# EAGLE design NB-IoT-ideaboard-v2.0 (EAGLE 8.7.1)

## Sheet 1 of 4
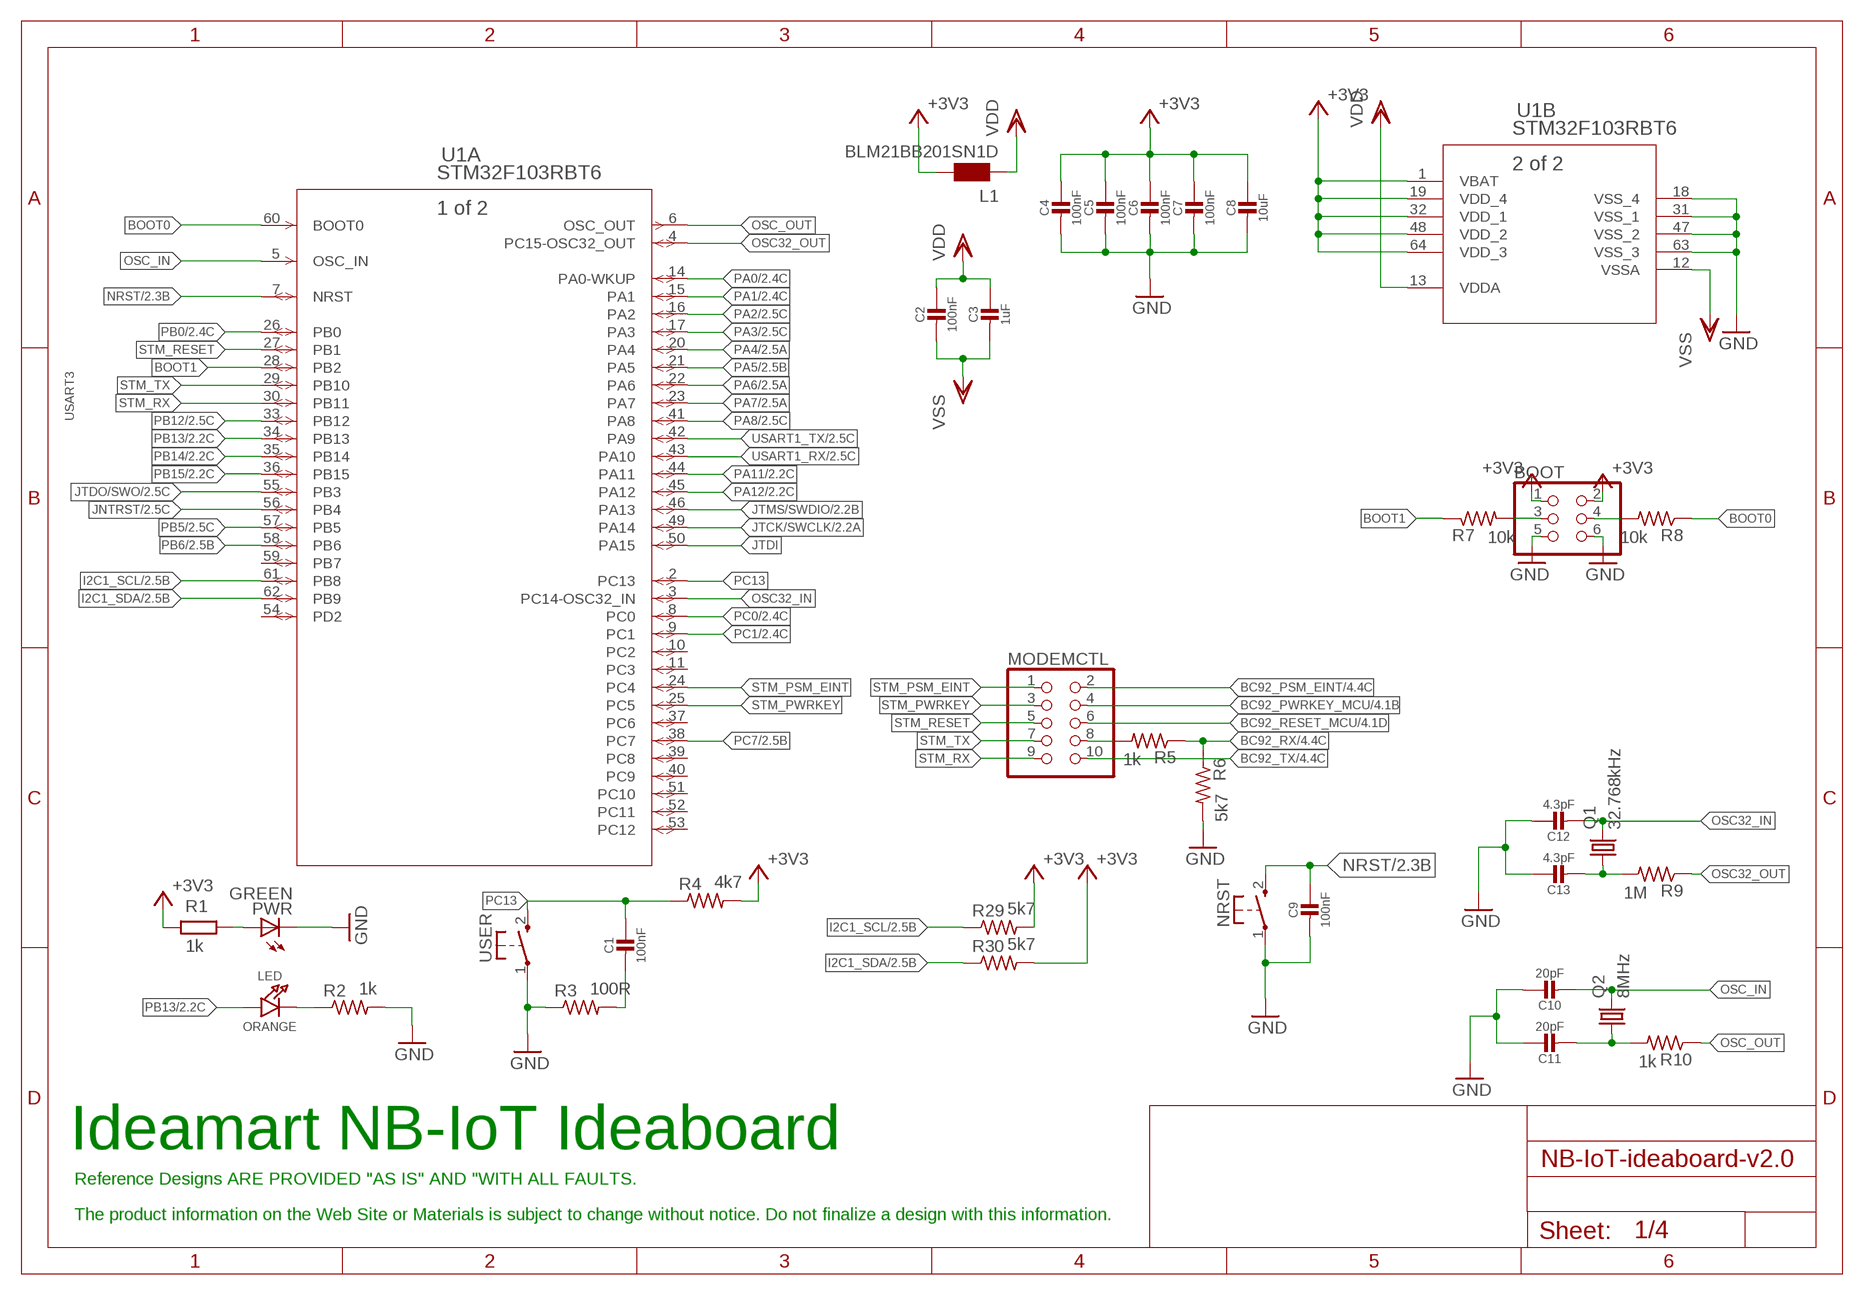
[diagram p0: schematic, sheet 1]

### Parts
BOOT  PINHD-2X03_2.54-SMD  [2X03SMD]
C1  100nF  CAP_CERAMIC_0805MP  [_0805MP]
C2  100nF  CAP_CERAMIC_0805MP  [_0805MP]
C3  1uF  CAP_CERAMIC_0805MP  [_0805MP]
C4  100nF  CAP_CERAMIC_0805MP  [_0805MP]
C5  100nF  CAP_CERAMIC_0805MP  [_0805MP]
C6  100nF  CAP_CERAMIC_0805MP  [_0805MP]
C7  100nF  CAP_CERAMIC_0805MP  [_0805MP]
C8  10uF  CAP_CERAMIC_0805MP  [_0805MP]
C9  100nF  CAP_CERAMIC_0805MP  [_0805MP]
C10  20pF  CAP_CERAMIC_0805MP  [_0805MP]
C11  20pF  CAP_CERAMIC_0805MP  [_0805MP]
C12  4.3pF  CAP_CERAMIC_0805MP  [_0805MP]
C13  4.3pF  CAP_CERAMIC_0805MP  [_0805MP]
L1  BLM21BB201SN1D  WE-CBF_0805  [0805]
LED  ORANGE  LED0805  [CHIPLED_0805]
MODEMCTL  PINHD-2X05_2.54-SMD  [2X05SMD]
NRST  KSS-2EG4430  [KSS-2EG4430]
PWR  GREEN  LEDCHIP-LED0805  [CHIP-LED0805]
Q1  32.768kHz  CRYSTALTC26H-SMD  [TC26H-SMD]
Q2  8MHz  CRYSTALSM49  [SM49]
R1  1k  R-EU_R0805  [R0805]
R2  1k  R-US_M0805  [M0805]
R3  100R  R-US_M0805  [M0805]
R4  4k7  R-US_M0805  [M0805]
R5  1k  R-US_M0805  [M0805]
R6  5k7  R-US_M0805  [M0805]
R7  10k  R-US_M0805  [M0805]
R8  10k  R-US_M0805  [M0805]
R9  1M  R-US_M0805  [M0805]
R10  1k  R-US_M0805  [M0805]
R29  5k7  R-US_M0805  [M0805]
R30  5k7  R-US_M0805  [M0805]
U1  STM32F103RBT6  [LQFP64-10X10MM]
USER  KSS-2EG4430  [KSS-2EG4430]

### Nets
+3V3: BOOT.1 BOOT.2 C4.1 C5.1 C6.1 C7.1 C8.1 L1.2 R1.2 R4.2 R29.2 R30.2 U1.1(B:VBAT) U1.19(B:VDD_4) U1.32(B:VDD_1) U1.48(B:VDD_2) U1.64(B:VDD_3) ; also sheet 2,3
BC92_PSM_EINT: MODEMCTL.2 ; also sheet 4
BC92_PWRKEY_MCU: MODEMCTL.4 ; also sheet 4
BC92_RESET_MCU: MODEMCTL.6 ; also sheet 4
BC92_RX: R5.1 R6.1 ; also sheet 4
BC92_TX: MODEMCTL.10 ; also sheet 4
BOOT0: R8.1 U1.60(A:BOOT0)
BOOT1: R7.1 U1.28(A:PB2)
GND [gnd]: BOOT.5 BOOT.6 C4.2 C5.2 C6.2 C7.2 C8.2 C9.2 C10.1 C11.1 C12.1 C13.1 NRST.1(P) PWR.C R2.2 R3.1 R6.2 U1.18(B:VSS_4) U1.31(B:VSS_1) U1.47(B:VSS_2) U1.63(B:VSS_3) USER.1(P) ; also sheet 2,3,4
I2C1_SCL: R29.1 U1.61(A:PB8) ; also sheet 2
I2C1_SDA: R30.1 U1.62(A:PB9) ; also sheet 2
JNTRST: U1.56(A:PB4) ; also sheet 2
JTCK/SWCLK: U1.49(A:PA14) ; also sheet 2
JTDI: U1.50(A:PA15)
JTDO/SWO: U1.55(A:PB3) ; also sheet 2
JTMS/SWDIO: U1.46(A:PA13) ; also sheet 2
N$1: BOOT.3 R7.2
N$3: PWR.A R1.1
N$7: C11.2 Q2.1 R10.2
N$8: C13.2 Q1.P$1 R9.2
N$19: C1.2 R3.2
N$25: BOOT.4 R8.2
N$26: LED.C R2.1
N$29: MODEMCTL.8 R5.2
NRST: C9.1 NRST.2(S) U1.7(A:NRST) ; also sheet 2
OSC32_IN: C12.2 Q1.P$2 U1.3(A:PC14-OSC32_IN)
OSC32_OUT: R9.1 U1.4(A:PC15-OSC32_OUT)
OSC_IN: C10.2 Q2.2 U1.5(A:OSC_IN)
OSC_OUT: R10.1 U1.6(A:OSC_OUT)
PA0: U1.14(A:PA0-WKUP) ; also sheet 2
PA1: U1.15(A:PA1) ; also sheet 2
PA2: U1.16(A:PA2) ; also sheet 2
PA3: U1.17(A:PA3) ; also sheet 2
PA4: U1.20(A:PA4) ; also sheet 2
PA5: U1.21(A:PA5) ; also sheet 2
PA6: U1.22(A:PA6) ; also sheet 2
PA7: U1.23(A:PA7) ; also sheet 2
PA8: U1.41(A:PA8) ; also sheet 2
PA11: U1.44(A:PA11) ; also sheet 2
PA12: U1.45(A:PA12) ; also sheet 2
PB0: U1.26(A:PB0) ; also sheet 2
PB5: U1.57(A:PB5) ; also sheet 2
PB6: U1.58(A:PB6) ; also sheet 2
PB12: U1.33(A:PB12) ; also sheet 2
PB13: LED.A U1.34(A:PB13) ; also sheet 2
PB14: U1.35(A:PB14) ; also sheet 2
PB15: U1.36(A:PB15) ; also sheet 2
PC0: U1.8(A:PC0) ; also sheet 2
PC1: U1.9(A:PC1) ; also sheet 2
PC7: U1.38(A:PC7) ; also sheet 2
PC13: C1.1 R4.1 U1.2(A:PC13) USER.2(S)
STM_PSM_EINT: MODEMCTL.1 U1.24(A:PC4)
STM_PWRKEY: MODEMCTL.3 U1.25(A:PC5)
STM_RESET: MODEMCTL.5 U1.27(A:PB1)
STM_RX: MODEMCTL.9 U1.30(A:PB11)
STM_TX: MODEMCTL.7 U1.29(A:PB10)
USART1_RX: U1.43(A:PA10) ; also sheet 2
USART1_TX: U1.42(A:PA9) ; also sheet 2
VDD: C2.1 C3.1 L1.1 U1.13(B:VDDA) ; also sheet 2
VSS: C2.2 C3.2 U1.12(B:VSSA)
Unconnected: U1.10(A:PC2) U1.11(A:PC3) U1.37(A:PC6) U1.39(A:PC8) U1.40(A:PC9) U1.51(A:PC10) U1.52(A:PC11) U1.53(A:PC12) U1.54(A:PD2) U1.59(A:PB7)

### Notes on the sheet
- USART3
- Ideamart NB-IoT Ideaboard
- Reference Designs ARE PROVIDED "AS IS" AND "WITH ALL FAULTS.
- The product information on the Web Site or Materials is subject to change without notice. Do not finalize a design with this information.

## Sheet 2 of 4
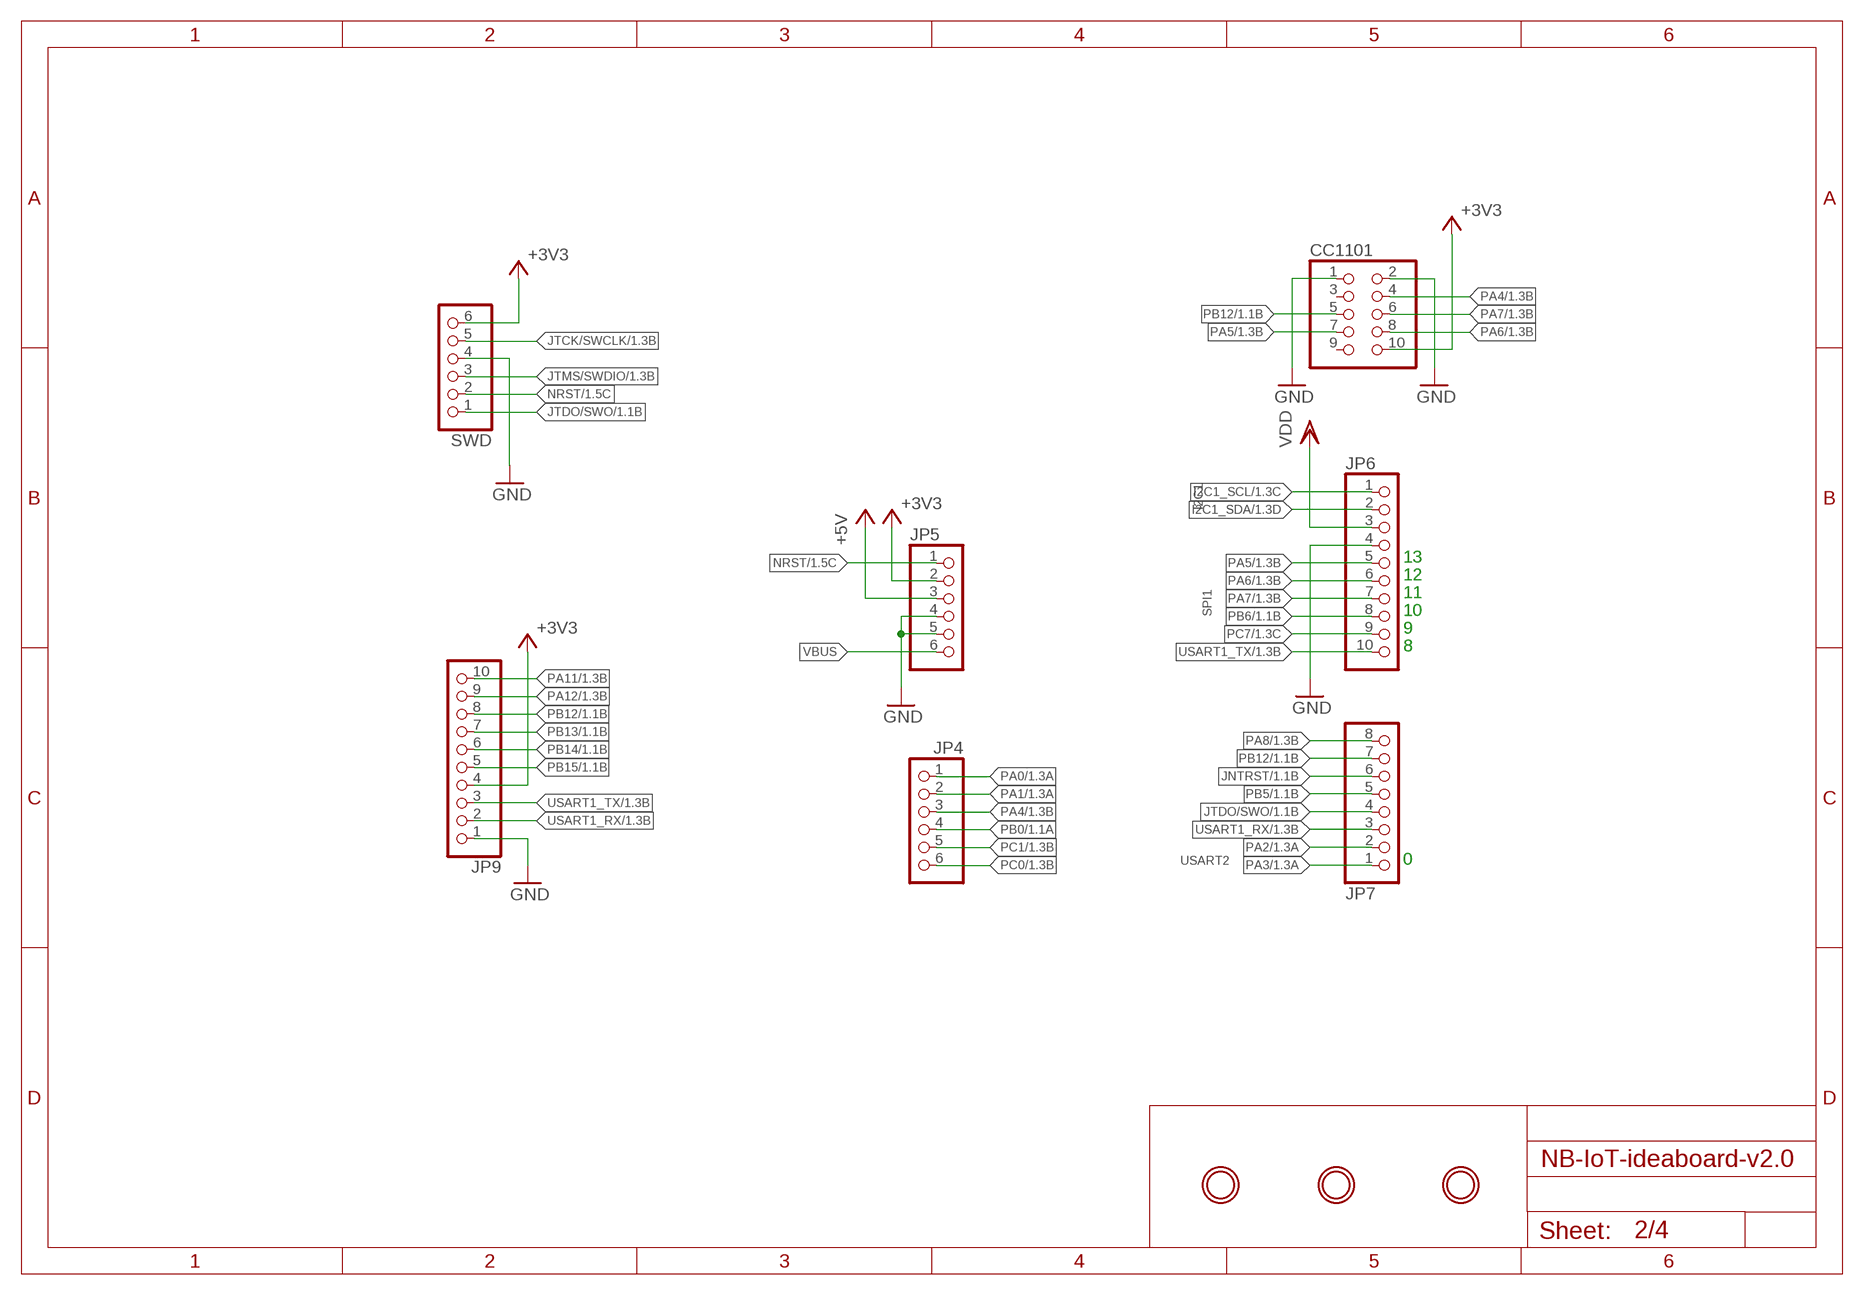
[diagram p1: schematic, sheet 2]

### Parts
$H1  MOUNTINGHOLE3.0THIN  [MOUNTINGHOLE_3.0_PLATEDTHIN]
$H2  MOUNTINGHOLE3.0THIN  [MOUNTINGHOLE_3.0_PLATEDTHIN]
$H3  MOUNTINGHOLE3.0THIN  [MOUNTINGHOLE_3.0_PLATEDTHIN]
CC1101  PINHD-2X05_2.54-SMD  [2X05SMD]
JP4  PINHD-1X6  [1X06]
JP5  PINHD-1X6  [1X06]
JP6  PINHD-1X10  [1X10]
JP7  PINHD-1X8  [1X08]
JP9  PINHD-1X10_2.54-S  [1X10-S]
SWD  PINHD-1X6  [1X06]

### Nets
+3V3: CC1101.10 JP5.2 JP9.4 SWD.6 ; also sheet 1,3
+5V [usbvcc]: JP5.3 ; also sheet 3
GND [gnd]: CC1101.1 CC1101.2 JP5.4 JP5.5 JP6.4 JP9.1 SWD.4 ; also sheet 1,3,4
I2C1_SCL: JP6.1 ; also sheet 1
I2C1_SDA: JP6.2 ; also sheet 1
JNTRST: JP7.6 ; also sheet 1
JTCK/SWCLK: SWD.5 ; also sheet 1
JTDO/SWO: JP7.4 SWD.1 ; also sheet 1
JTMS/SWDIO: SWD.3 ; also sheet 1
NRST: JP5.1 SWD.2 ; also sheet 1
PA0: JP4.1 ; also sheet 1
PA1: JP4.2 ; also sheet 1
PA2: JP7.2 ; also sheet 1
PA3: JP7.1 ; also sheet 1
PA4: CC1101.4 JP4.3 ; also sheet 1
PA5: CC1101.7 JP6.5 ; also sheet 1
PA6: CC1101.8 JP6.6 ; also sheet 1
PA7: CC1101.6 JP6.7 ; also sheet 1
PA8: JP7.8 ; also sheet 1
PA11: JP9.10 ; also sheet 1
PA12: JP9.9 ; also sheet 1
PB0: JP4.4 ; also sheet 1
PB5: JP7.5 ; also sheet 1
PB6: JP6.8 ; also sheet 1
PB12: CC1101.5 JP7.7 JP9.8 ; also sheet 1
PB13: JP9.7 ; also sheet 1
PB14: JP9.6 ; also sheet 1
PB15: JP9.5 ; also sheet 1
PC0: JP4.6 ; also sheet 1
PC1: JP4.5 ; also sheet 1
PC7: JP6.9 ; also sheet 1
USART1_RX: JP7.3 JP9.2 ; also sheet 1
USART1_TX: JP6.10 JP9.3 ; also sheet 1
VBUS [usbvcc]: JP5.6 ; also sheet 3
VDD: JP6.3 ; also sheet 1
Unconnected: CC1101.3 CC1101.9

### Notes on the sheet
- I2C1
- 13
- 12
- 11
- SPI1 | 10
- 9
- 8
- USART2
- 0

## Sheet 3 of 4
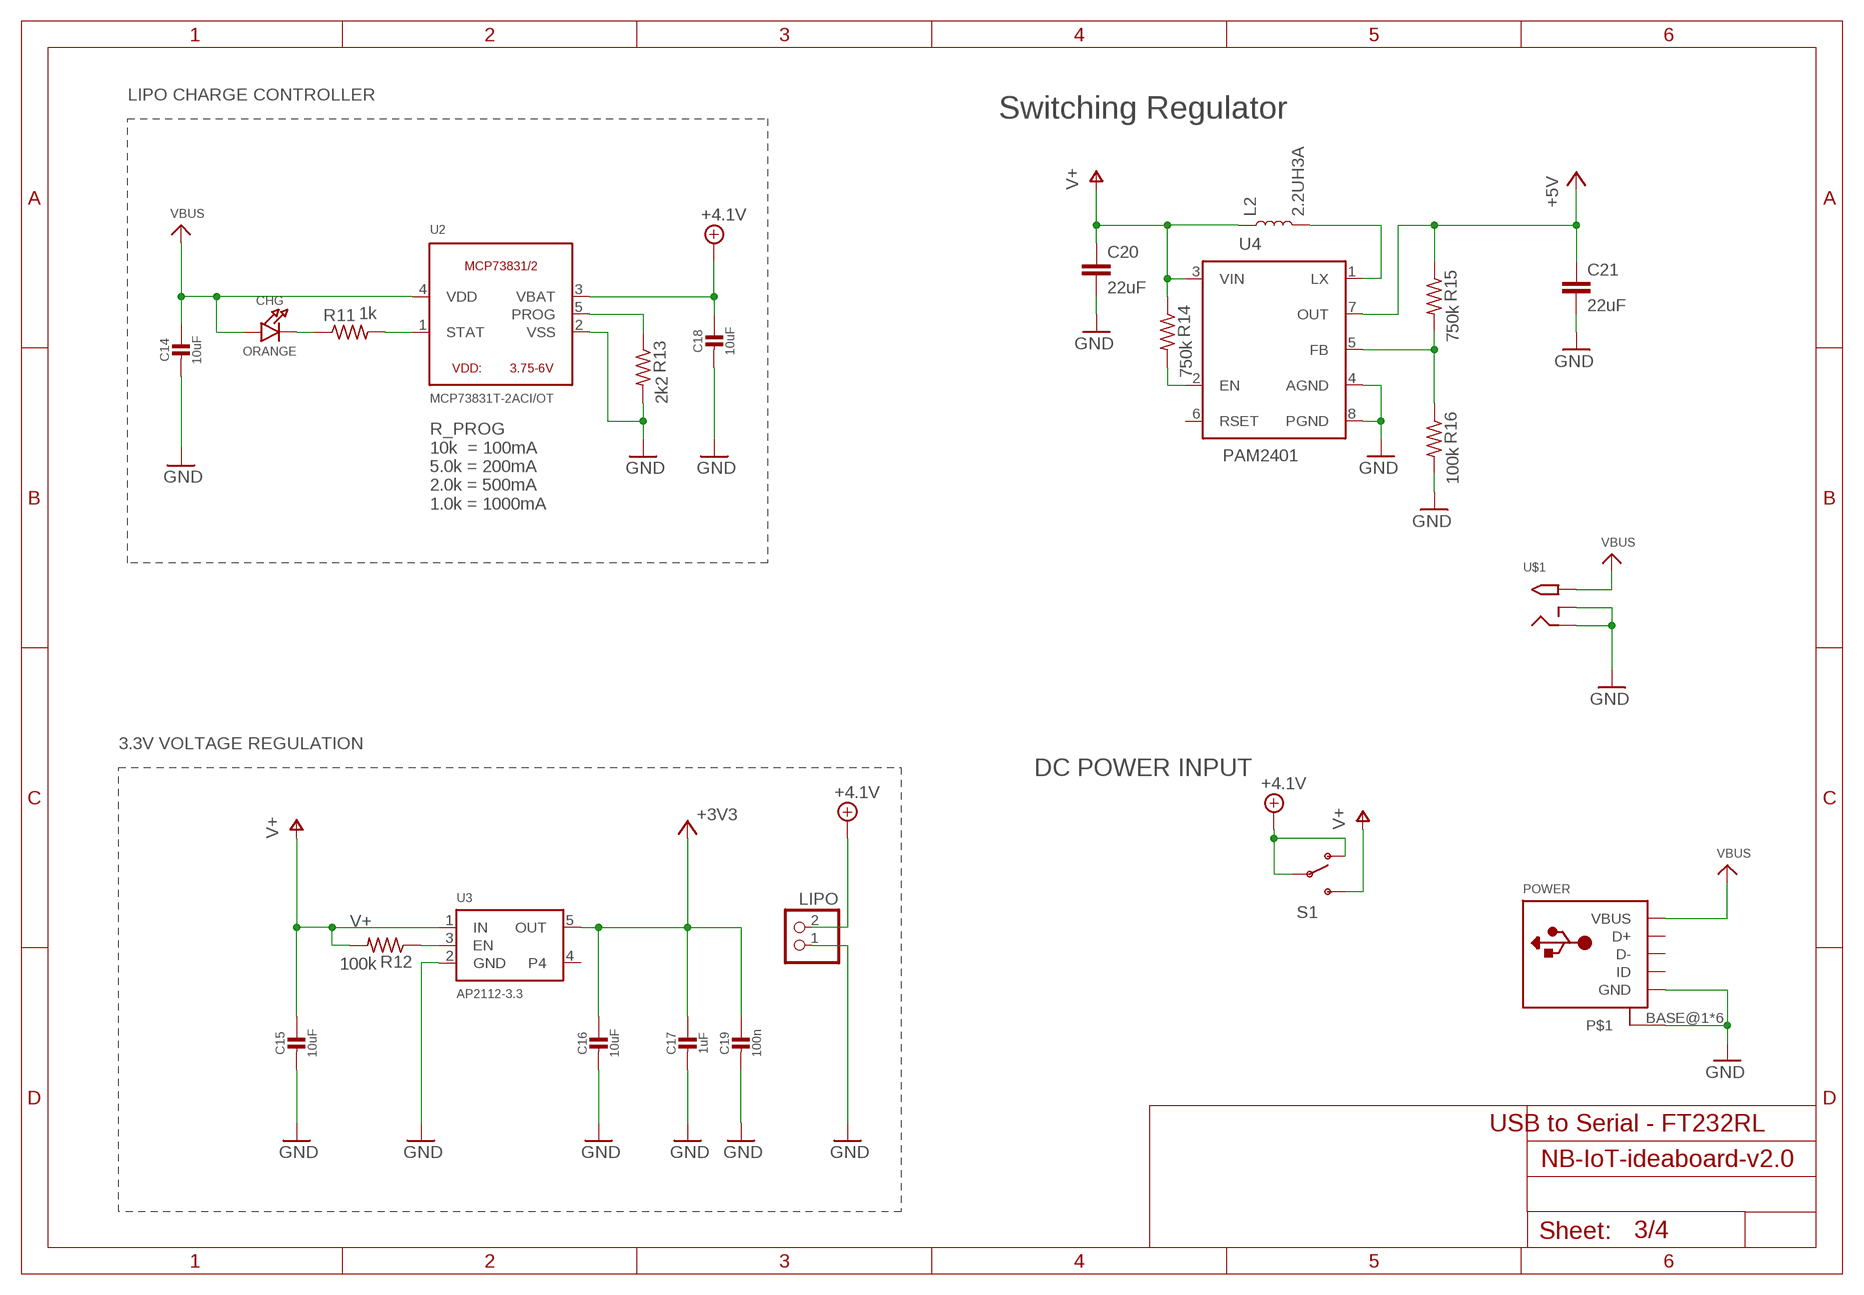
[diagram p2: schematic, sheet 3]

### Parts
C14  10uF  CAP_CERAMIC_0805  [_0805]
C15  10uF  CAP_CERAMIC_0805MP  [_0805MP]
C16  10uF  CAP_CERAMIC_0805MP  [_0805MP]
C17  1uF  CAP_CERAMIC_0805MP  [_0805MP]
C18  10uF  CAP_CERAMIC_0805  [_0805]
C19  100n  CAP_CERAMIC_0805MP  [_0805MP]
C20  22uF  22UF-0805-6.3V-20%  [0805]
C21  22uF  22UF-0805-6.3V-20%  [0805]
CHG  ORANGE  LED0805  [CHIPLED_0805]
L2  2.2UH3A  INDUCTOR-IFSC1515AHER2R2M01  [INDUCTOR_4X4MM]
LIPO  JST_2PIN-SMT  [JST-PH-2-SMT]
POWER  USB_MICRO_20329_V2  [4UCONN_20329_V2]
R11  1k  R-US_M0805  [M0805]
R12  100k  R-US_M0805  [M0805]
R13  2k2  R-US_M0805  [M0805]
R14  750k  R-US_M0805  [M0805]
R15  750k  R-US_M0805  [M0805]
R16  100k  R-US_M0805  [M0805]
S1  SWITCH-SPDT-SMD-A  [SWITCH-SPST-SMD-A]
U2  MCP73831T-2ACI/OT  MCP73831/2  [SOT23-5]
U3  AP2112-3.3  VREG_SOT23-5  [SOT23-5]
U4  PAM2401  [MSOP8]
U$1  2.1MMJACKSMT  [DCJACK_2MM_SMT]

### Nets
+3V3: C16.1 C17.1 C19.1 U3.5(OUT) ; also sheet 1,2
+4.1V: C18.1 LIPO.2 S1.1(O) S1.2(P) U2.3(VBAT)
+5V [usbvcc]: C21.1 R15.1 U4.7(OUT) ; also sheet 2
EN: R14.2 U4.2(EN)
GND [gnd]: C14.2 C15.2 C16.2 C17.2 C18.2 C19.2 C20.2 C21.2 LIPO.1 POWER.BASE@1 POWER.BASE@2 POWER.GND POWER.SPRT@1 POWER.SPRT@2 POWER.SPRT@3 POWER.SPRT@4 R13.2 R16.2 U2.2(VSS) U3.2(GND) U4.4(AGND) U4.8(PGND) U$1.GND(RING) U$1.GNDBREAK(RING_SW) ; also sheet 1,2,4
N$5: R12.1 U3.3(EN)
N$9: CHG.C R11.1
N$11: R11.2 U2.1(STAT)
N$20: R13.1 U2.5(PROG)
N$21: R15.2 R16.1 U4.5(FB)
N$22: L2.P$2 U4.1(LX)
V+: C15.1 C20.1 L2.P$1 R12.2 R14.1 S1.3(S) U3.1(IN) U4.3(VIN) ; also sheet 4
VBUS [usbvcc]: C14.1 CHG.A POWER.VBUS U2.4(VDD) U$1.PWR2(TIP) ; also sheet 2
Unconnected: POWER.D+ POWER.D- POWER.ID U3.4 U4.6(RSET)

### Notes on the sheet
- LIPO CHARGE CONTROLLER
- Switching Regulator
- R_PROG
  10k  = 100mA
  5.0k = 200mA
  2.0k = 500mA
  1.0k = 1000mA
- 3.3V VOLTAGE REGULATION
- DC POWER INPUT
- USB to Serial - FT232RL

## Sheet 4 of 4
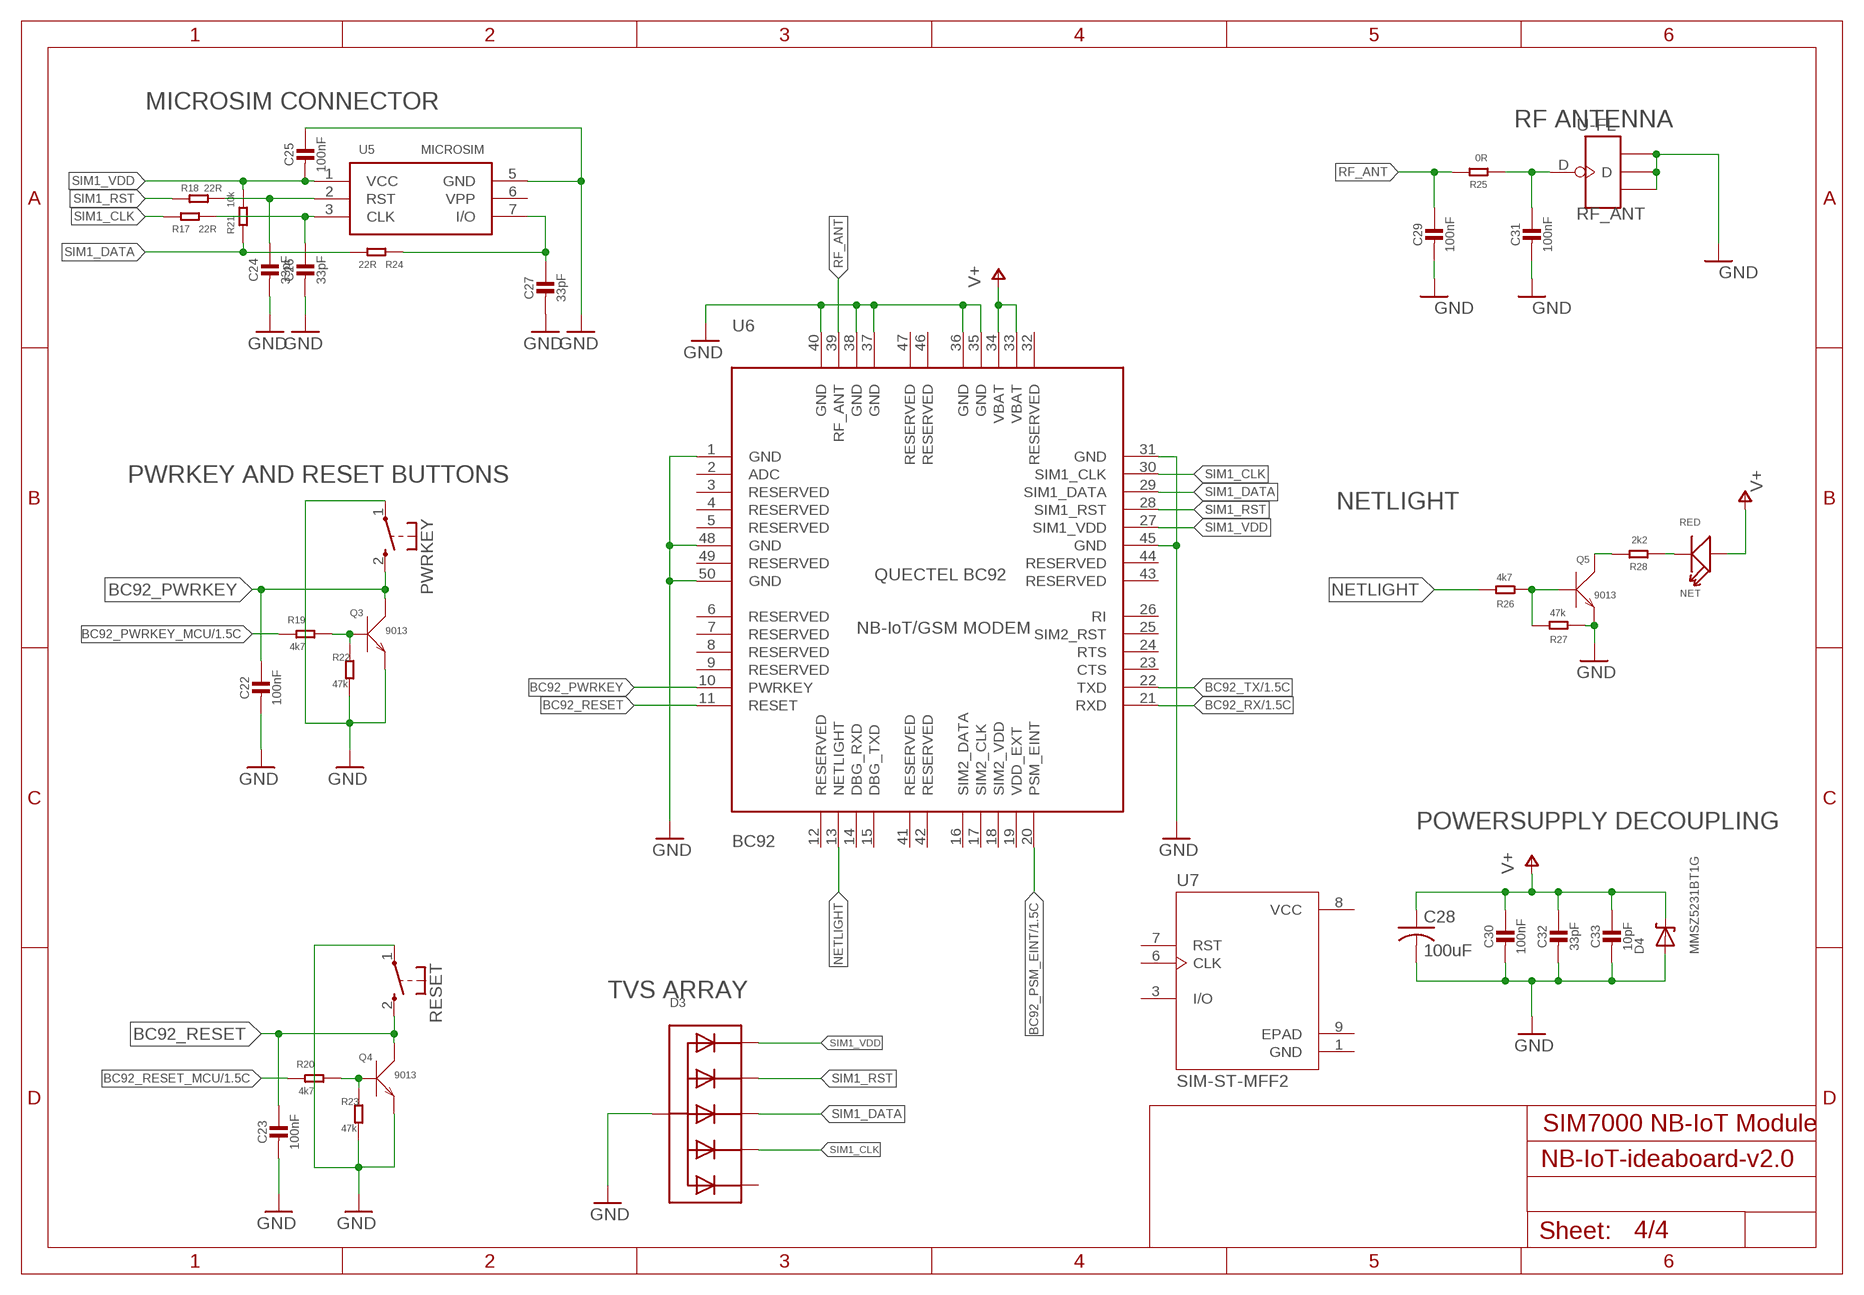
[diagram p3: schematic, sheet 4]

### Parts
C22  100nF  CAP_CERAMIC_0805  [_0805]
C23  100nF  CAP_CERAMIC_0805  [_0805]
C24  33pF  CAP_CERAMIC_0805  [_0805]
C25  100nF  CAP_CERAMIC_0805  [_0805]
C26  33pF  CAP_CERAMIC_0805  [_0805]
C27  33pF  CAP_CERAMIC_0805  [_0805]
C28  100uF  C-USC1210  [C1210]
C29  100nF  CAP_CERAMIC_0805  [_0805]
C30  100nF  CAP_CERAMIC_0805  [_0805]
C31  100nF  CAP_CERAMIC_0805  [_0805]
C32  33pF  CAP_CERAMIC_0805  [_0805]
C33  10pF  CAP_CERAMIC_0805  [_0805]
D3  TVSARRAY_5LANE  [SOT363]
D4  MMSZ5231BT1G  DIODE-ZENERSOD123  [SOD-123]
NET  RED  LED'0805'  [LED-0805]
PWRKEY  KSS-2EG4430  [KSS-2EG4430]
Q3  9013  TRANSISTOR-NPN-SOT23  [SOT23]
Q4  9013  TRANSISTOR-NPN-SOT23  [SOT23]
Q5  9013  TRANSISTOR-NPN-SOT23  [SOT23]
R17  22R  R-0805  [0805]
R18  22R  R-0805  [0805]
R19  4k7  R-0805  [0805]
R20  4k7  R-0805  [0805]
R21  10k  R-0805  [0805]
R22  47k  R-0805  [0805]
R23  47k  R-0805  [0805]
R24  22R  R-0805  [0805]
R25  0R  R-0805  [0805]
R26  4k7  R-0805  [0805]
R27  47k  R-0805  [0805]
R28  2k2  R-0805  [0805]
RESET  KSS-2EG4430  [KSS-2EG4430]
RF_ANT  U-FL  ANTENNA-U-FL  [4P-U-FL]
U5  MICROSIM  [MICROSIM]
U6  BC92  [BC92]
U7  SIM-ST-MFF2  [PSON127P500X600X82-9N]

### Nets
BC92_PSM_EINT: U6.20(PSM_EINT) ; also sheet 1
BC92_PWRKEY: C22.1 PWRKEY.2(S) Q3.3(C) U6.10(PWRKEY)
BC92_PWRKEY_MCU: R19.1 ; also sheet 1
BC92_RESET: C23.1 Q4.3(C) RESET.2(S) U6.11(RESET)
BC92_RESET_MCU: R20.1 ; also sheet 1
BC92_RX: U6.21(RXD) ; also sheet 1
BC92_TX: U6.22(TXD) ; also sheet 1
GND [gnd]: C22.2 C23.2 C24.2 C25.1 C26.2 C27.2 C28.2 C29.2 C30.2 C31.2 C32.2 C33.2 D3.2(A) D4.A PWRKEY.1(P) Q3.2(E) Q4.2(E) Q5.2(E) R22.2 R23.2 R27.2 RESET.1(P) RF_ANT.GND1 RF_ANT.GND2 RF_ANT.GND3 U5.5(GND) U6.1(GND) U6.31(GND) U6.35(GND) U6.36(GND) U6.37(GND) U6.38(GND) U6.40(GND) U6.45(GND) U6.48(GND) U6.50(GND) ; also sheet 1,2,3
N$6: C31.1 R25.1 RF_ANT.D
N$10: C27.1 R24.1 U5.7(I/O)
N$12: C26.1 R17.1 U5.3(CLK)
N$13: C24.1 R18.1 U5.2(RST)
N$14: Q4.1(B) R20.2 R23.1
N$16: Q5.3(C) R28.2
N$17: NET.- R28.1
N$18: Q5.1(B) R26.2 R27.1
N$36: Q3.1(B) R19.2 R22.1
NETLIGHT: R26.1 U6.13(NETLIGHT)
RF_ANT [antenna]: C29.1 R25.2 U6.39(RF_ANT)
SIM1_CLK: D3.5(C4) R17.2 U6.30(SIM1_CLK)
SIM1_DATA: D3.4(C3) R21.1 R24.2 U6.29(SIM1_DATA)
SIM1_RST: D3.3(C2) R18.2 U6.28(SIM1_RST)
SIM1_VDD: C25.2 D3.1(C1) R21.2 U5.1(VCC) U6.27(SIM1_VDD)
V+: C28.1 C30.1 C32.1 C33.1 D4.C NET.+ U6.33(VBAT) U6.34(VBAT) ; also sheet 3
Unconnected: D3.6(C5) U5.6(VPP) U6.2(ADC) U6.3(RESERVED) U6.4(RESERVED) U6.5(RESERVED) U6.6(RESERVED) U6.7(RESERVED) U6.8(RESERVED) U6.9(RESERVED) U6.12(RESERVED) U6.14(DBG_RXD) U6.15(DBG_TXD) U6.16(SIM2_DATA) U6.17(SIM2_CLK) U6.18(SIM2_VDD) U6.19(VDD_EXT) U6.23(CTS) U6.24(RTS) U6.25(SIM2_RST) U6.26(RI) U6.32(RESERVED) U6.41(RESERVED) U6.42(RESERVED) U6.43(RESERVED) U6.44(RESERVED) U6.46(RESERVED) U6.47(RESERVED) U6.49(RESERVED) U7.3(I/O) U7.6(CLK) U7.7(RST) U7.9(EPAD)

### Notes on the sheet
- MICROSIM CONNECTOR
- RF ANTENNA
- PWRKEY AND RESET BUTTONS
- NETLIGHT
- POWERSUPPLY DECOUPLING
- TVS ARRAY
- SIM7000 NB-IoT Module

## Power pins joined to a net without a drawn wire
GND: U7.1(GND)
VCC: U7.8(VCC)

## Library data of the parts
$H1-$H3 = Adafruit SIM808 Breakout:MOUNTINGHOLE: Mounting Hole For #2 screws (0.086"/2.18mm width, 0.094"/2.4mm hole) use 2.5mm; BOM: EXCLUDE
BOOT = pinhead-2:PINHD-2X03: PIN HEADER
C1-C19 C22-C27 C29-C33 = Adafruit111:CAP_CERAMIC: Ceramic Capacitors For new designs, use the packages preceded by an '_' character since they are more reliable: The following footprints should be used on most boards: _0402 - Standard footprint for regular board layouts _0603 - Standard footprint for regular board layouts _0805 - Standard footprint for regular board layouts _1206 - Standard footprint for regular board layouts For extremely tight-pitch boards where space is at a premium, the following 'micro-pitch' footprints can be used (smaller pads, no silkscreen outline, etc.): _0402MP - Micro-pitch footprint for very dense/compact boards _0603MP - Micro-pitch footprint for very dense/compact boards _0805MP - Micro-pitch footprint for very dense/compact boards _1206MP - Micro-pitch footprint for very dense/compact boards
C20 C21 = SparkFun-Capacitors:22UF: 22µF ceramic capacitors A capacitor is a passive two-terminal electrical component used to store electrical energy temporarily in an electric field.; PROD_ID: CAP-08402
C28 = Adafruit SIM808 Breakout:C-US: CAPACITOR, American symbol
CC1101 MODEMCTL = pinhead-2:PINHD-2X05: PIN HEADER
CHG LED = LED-adafruit:LED: LED
D3 = Adafruit SIM808 Breakout:TVSARRAY_5LANE: Voltage Transient Suppressor Array SOT363 SMF05C - 100W 5V: Digikey - SMF05CT1GOSCT-ND
D4 = Adafruit SIM808 Breakout:DIODE-ZENER: Zener Diode SMA: 30V 1W Zener Diode, 1.2Vf - Digikey: SMAZ30-FDICT-ND
JP4 JP5 SWD = pinhead:PINHD-1X6: PIN HEADER
JP6 = pinhead:PINHD-1X10: PIN HEADER
JP7 = pinhead:PINHD-1X8: PIN HEADER
JP9 = pinhead-2:PINHD-1X10: PIN HEADER
L1 = wuerth-elektronik:WE-CBF: SMD EMI Suppression Ferrite Beads - excellent anti-EMI properties - low DCR - impedances till 3000 ohms - rated current up to 6 A
L2 = SparkFun-Coils:INDUCTOR: Inductors Resist changes in electrical current. Basically a coil of wire. SparkFun Products: SparkFun Load Cell Amplifier - HX711 <https://www.sparkfun.com/products/13879> IOIO-OTG - V2.2 <https://www.sparkfun.com/products/13613>; PROD_ID: NDUC-13770
LIPO = adafruit:JST_2PIN: JST 2-Pin Connectors of various flavors SMT-RA (S2B-PH-SM4) 4UConnector #17311 SMT (B2B-PH-SM4) THM-RA (S2B-PH) THM (B2B-PH)
NET = discrete:LED*
NRST PWRKEY RESET USER = buttons:KSS-2EG4430: Size: 3x6mm Height: 5mm from PCB Rating: DC12v 50mA Travel: 0.25±0.10mm Operating Force: 180±50gf Return Force: 60gf min Contact resistance: 100m? max Insulation resistance: 100M? min Operating life?50,000 cycles
POWER = Adafruit SIM808 Breakout:USB: USB Connectors USBMINIB - Surface Mount Female Mini-B USB Connector 4UConnector: 06564
PWR = led:LED: LED
Q1 = adafruit:CRYSTAL: CRYSTAL
Q2 = adafruit:CRYSTAL: CRYSTAL; OC_FARNELL: unknown; OC_NEWARK: unknown
Q3-Q5 = discrete:TRANSISTOR-NPN*: NPN audion
R1 = SmartPrj:R-EU_: RESISTOR, European symbol
R2-R16 R29 R30 = resistor:R-US_: RESISTOR, American symbol
R17-R28 = discrete:R*
RF_ANT = Connector:ANTENNA-U-FL
S1 = SparkFun-Electromechanical:SWITCH-SPDT: SPDT Switch Simple slide switch, Spark Fun Electronics SKU : COM-00102 DPDT SMT slide switch, AYZ0202, SWCH-08179; PROD_ID: SWCH-10651
U1 = STM32F103RBT6:STM32F103RBT6; BUILT_BY: EMA_UL_Team; COPYRIGHT: Copyright (C) 2018 Accelerated Designs. All rights reserved; MANUFACTURER_PART_NUMBER: STM32F103RBT6; SOURCELIBRARY: Updates_to_database_2020-10-19; VENDOR: STMicroelectronics
U2 = MCP73831:MCP73831/2: MCP73831/2 LIPO Charger VDD: 3.75 - 6V Temp -40 - 85°C Programmable Charge Rate: 15-500mA NOTE: STAT is a tri-state logic output on the MCP73831 and an open-drain output on the MCP73832. SOT23-5 with 4.2V output and tri-state logic on STAT = MCP73831T-2ACI/OT
U3 = AP2112 3.3 Reg:VREG_SOT23-5: SOT23-5 Fixed Voltage Regulators Part Current Out V Out V In V Dropout ?JA (°C/W) TJ (°C) Digikey Part No. ADP121 150mA 3.3V 3.4-5.5V 0.09V @ 150mA -- -- ADP121-AUJZ33R7CT-ND ADP121 150mA 3.0V 3.1-5.5V 0.09V @ 150mA -- -- ADP121-AUJZ30R7CT-ND ADP122 300mA 3.3V 3.4-5.5V 0.085V @ 300mA -- -- ADP122AUJZ-3.3-R7CT-ND ADP1712 300mA 3.3V 3.5-5.5V 0.17V @ 300mA -- -- ADP1712AUJZ-3.3-R7TR-ND AP7311 (Low Cost) 150mA 3.3V 3.5-6V 0.15V @ 150mA -- -- AP7311-33WG-7DICT-ND LD39015M18R 150mA 1.8V 1.9V-5.5V 0.08V @ 100mA -- -- 497-6977-1-ND LP2985A-33DBVR 150mA 3.3V 3.3-16V 0.28V @ 150mA 206 150 296-18479-1-ND MCP1824T-3302E/OT 300mA 3.3V 3.5V-6V 0.2V @ 300mA -- -- MCP1824T-3302E/OTCT-ND MIC5205-2.5YM5 TR 150mA 2.5V 2.7-16V 0.165V @ 150mA -- -- 576-1257-2-ND MIC5205-3.0YM5 TR 150mA 3.0V 3.2V-16V 0.165V @ 150mA -- -- 576-1258-2-ND MIC5205-3.3YM5 TR 150mA 3.3V 3.5V-16V 0.165V @ 150mA -- -- 576-1259-2-ND TPS780330220 150mA 3.3V+2.2V 3.6-5.5V 250mV Max -- -- 296-23332-1-ND TDA3663/N1,135 100mA 3.3V 3.5-45V 0.18V @ 50mA -- -- 568-5343-1-ND Max operating temp can be calculated using ?JA, TJ (max junction temperature), and power in watts. Set the "Maximum Ambient Temperature" until it reaches TJ ("Max Junction Temperature"), which is the absolute limit for safe use of the regulator: Heat Sink Temperature Calculator <http://www.daycounter.com/Calculators/Heat-Sink-Temperature-Calculator.phtml> For example, With 12V source into a 3.3V LP2985 and a 30mA load, we are dissipating (12V-3.3V) * 0.03A = 0.261W. With a ?JA of 206 °C/W, a TJ of 150°C, and 261mW we can safely use the chip without a heat sink up to 75°C (=147.1°C Junction Temperature).
U4 = SparkFun-IC-Power:PAM2401: PAM2401 - Boost PMIC Specifications: Up to 1A output current 0.9V to 4.75V Input Range 2.5V to 5.0V Adjustable Output Voltage Datasheet <https://www.diodes.com/assets/Datasheets/PAM2401.pdf> (Diodes inc.); PROD_ID: IC-13769
U5 = GPRS+GSM+GPS Shield v1.0:MICROSIM
U6 = Quectel:BC92
U7 = SIM-ST-MFF2:SIM-ST-MFF2: GLOBAL IOT EMBEDDED SIM CHIP Check prices <https://pricing.snapeda.com/parts/SIM-ST-MFF2/Hologram%2C%20Inc./view-part?ref=eda>; AVAILABILITY: Bad; DESCRIPTION: GLOBAL IOT EMBEDDED SIM CHIP; MF: Hologram, Inc.; MP: SIM-ST-MFF2; PACKAGE: None; PRICE: None
U$1 = adafruit:2.1MMJACK: 2.1mm x 5.5mm THM DC jack with internal switch. Digikey part #PJ-102A, 4UCON part #05537 2.1mm x 5.5mm SMT DC jack with internal switch. Digikey part #PJ-002A-SMT, 4UCON part #03267 By microbuilder.eu & adafruit.com

## Net classes
0 default: width 0.203 mm, drill 0.356 mm, clearance 0.203 mm
1 power: width 0.254 mm, drill 0.356 mm, clearance 0.203 mm
2 gnd: width 0.203 mm, drill 0.356 mm, clearance 0.203 mm
3 usbvcc: width 0.203 mm, drill 0.356 mm, clearance 0.203 mm
4 aref: width 0.203 mm, drill 0.356 mm, clearance 0.203 mm
5 antenna: width 0.33 mm, drill 0.356 mm, clearance 0.559 mm
6 usb_diff: width 0.203 mm, drill 0.356 mm, clearance 0.203 mm

## Board
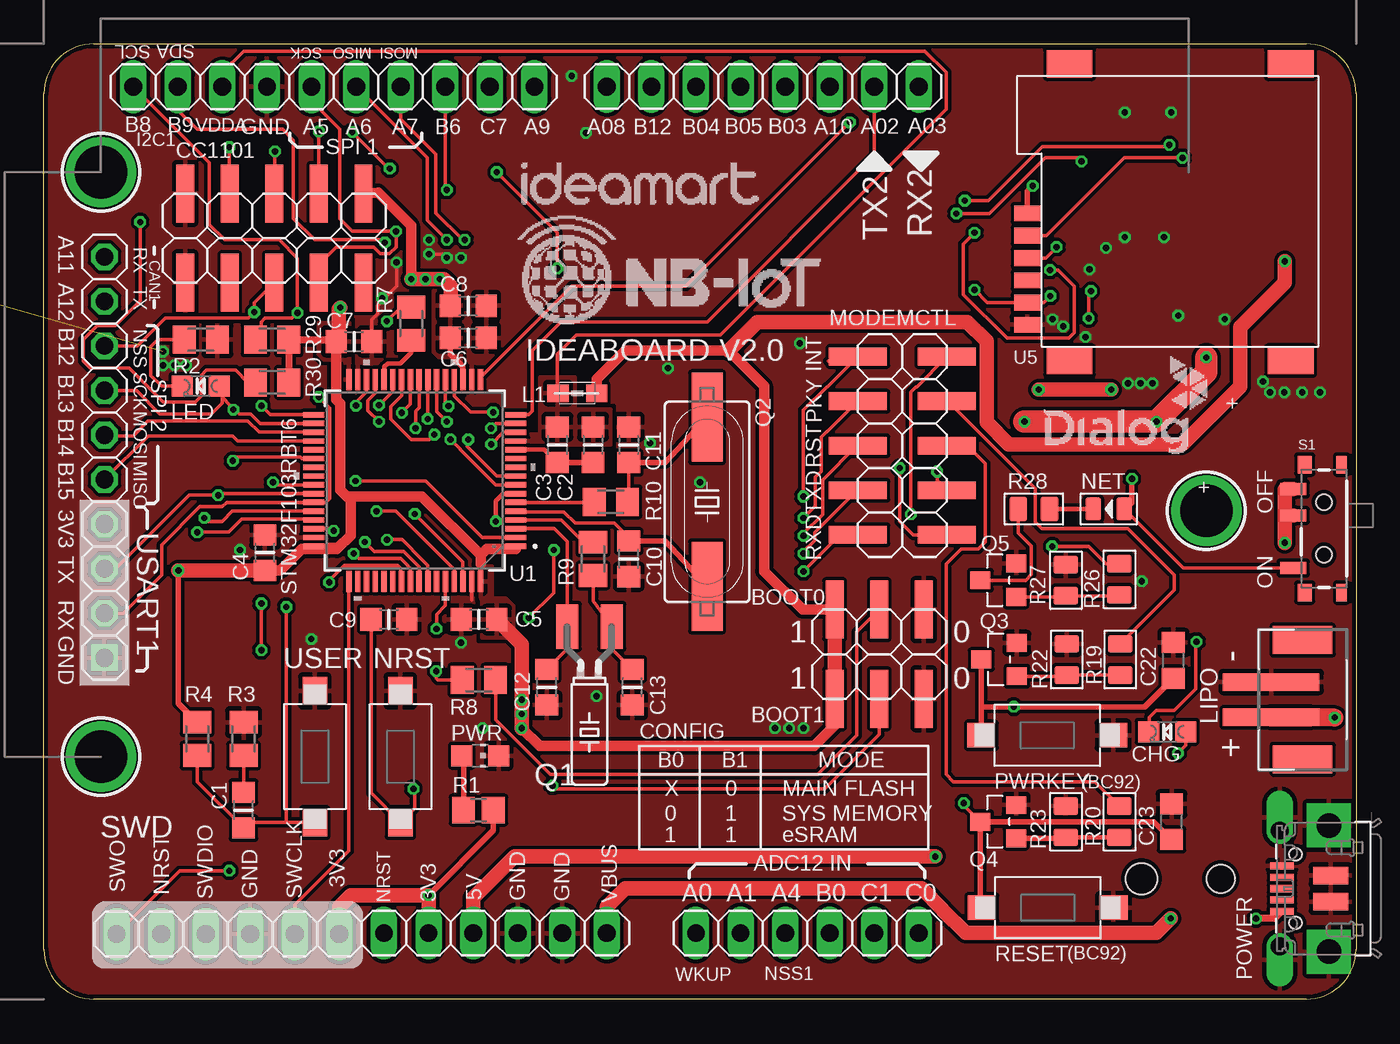
[diagram p4: board, top side]
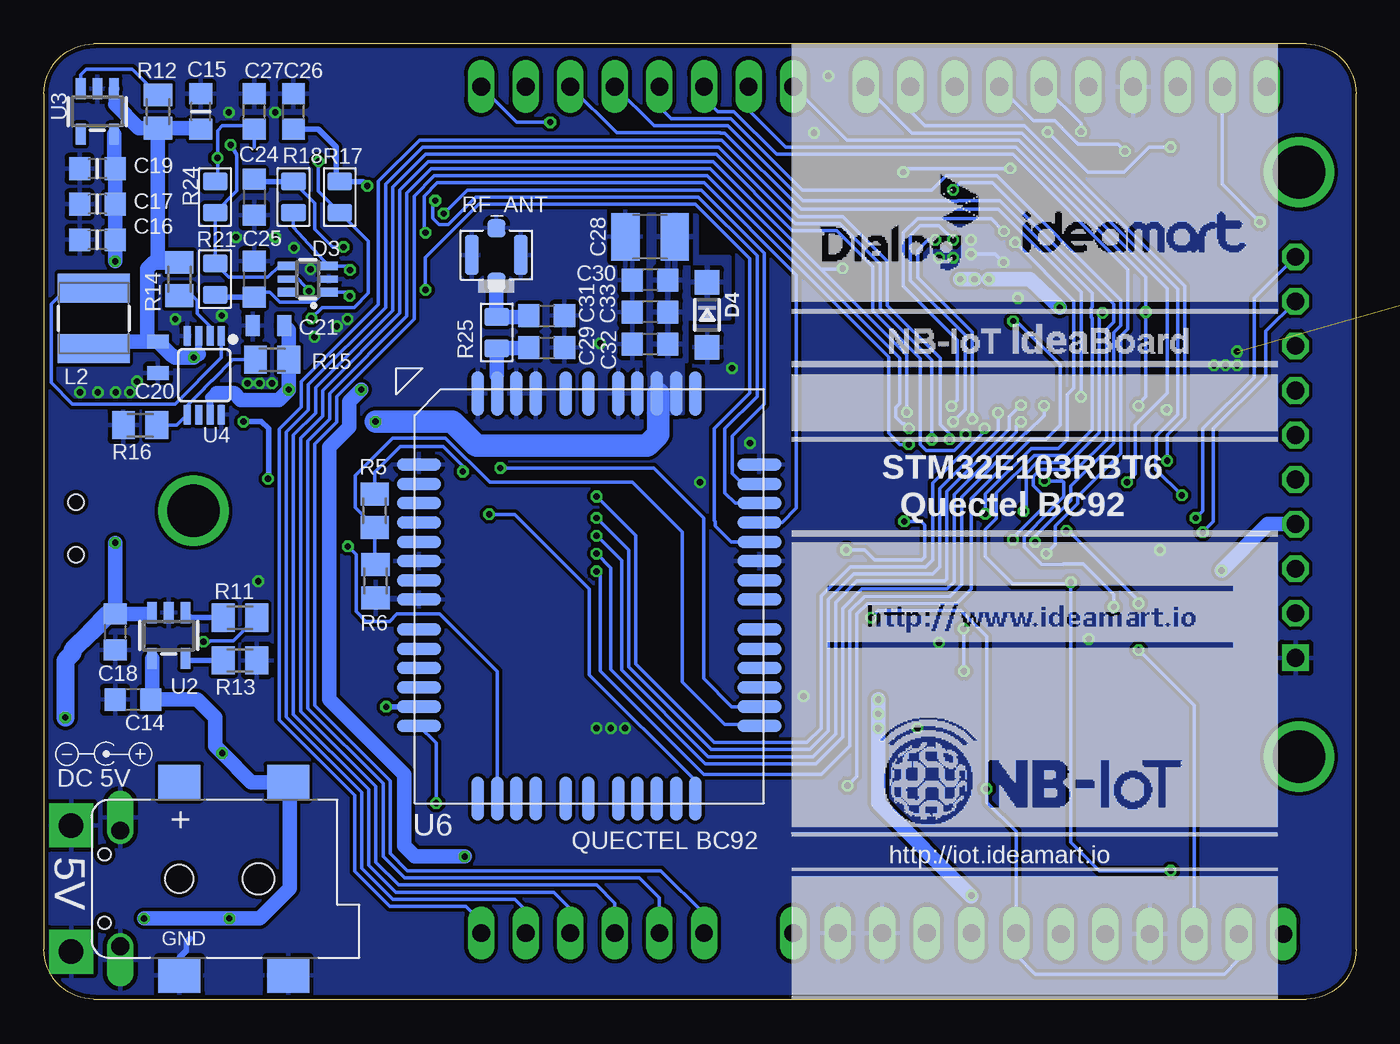
[diagram p5: board, bottom side, seen from below]

Size 74.78 x 54.46 mm. Coordinates in mm from the lower left corner, seen from the top.
Outline: 74.78,51.61 74.78,2.85 arc-90 71.93,0 2.85,0 arc-90 0,2.85 0,51.61 arc-90 2.85,54.46 71.93,54.46 arc-90 74.78,51.61
Copper layers (1*16): Top 0.035mm / dielectric 1.5mm / Bottom 0.035mm
Design rules "default *": minimum track width 8mil, minimum drill 14mil, track to track 8mil, track to pad 8mil, pad to pad 8mil, via to via 8mil, smd to smd 8mil, copper to edge 10mil, drill to drill 10mil, minimum pad ring 6mil, minimum via ring 6mil, stop-mask expansion 4mil, vias tented up to drill 24mil, thermal gap 10mil
vRestrict: area 22.9,44.1 to 24.6,49.1; area 25.4,45.5 to 27.1,49.1; area 28.4,45.3 to 29.6,48.8; area 31,45.3 to 32.1,48.8; area 33.5,45.3 to 34.7,48.8; area 36.1,45.3 to 37.2,48.8; area 38.7,47.2 to 39.9,48.8; area 40.3,45.1 to 47.6,46.9; area 60.3,44.2 to 61.7,46.7; area 62.9,44.2 to 64.3,46.7; area 61.3,35.8 to 64.8,37.2; area 0.6,21.8 to 2,30.1; area 5.7,22.6 to 7.4,30.1; area 47.9,10.3 to 48.5,10.8; area 50.4,10.2 to 50.9,11; area 11.3,28.8 to 12.7,31.1; area 44.8,47.5 to 46.1,48.9; area 47.6,47.4 to 48.8,48.9; area 50.2,47.4 to 51.3,48.9; area 52.8,47.4 to 54,48.9; area 55.2,47.4 to 56.4,48.9; area 57.9,47.4 to 59.1,48.9; area 60.5,47.4 to 61.6,48.9; area 63,47.4 to 64.1,48.9; area 41.3,47.2 to 42.4,48.8; area 0.3,12.4 to 9.4,24.5

### Footprints (pad centres in the part's own frame; a part is rotated, then mirrored left to right if it is on the bottom)
MOUNTINGHOLE_3.0_PLATEDTHIN = drill 3 pad 3.6: P$1 0,0
2X03SMD = smd 1.016 x 3.302: 1 -1.27,-3.81; 2 -1.27,1.27; 3 1.27,-3.81; 4 1.27,1.27; 5 3.81,-3.81; 6 3.81,1.27
_0805MP = smd 1.2 x 1.3: 1 -1.016,0; 2 1.016,0
_0805 = smd 1.2 x 1.3: 1 -1.016,0; 2 1.016,0
0805 = smd 0.8 x 1.2: 1 -0.9,0; 2 0.9,0
C1210 = smd 1.6 x 2.7: 1 -1.4,0; 2 1.4,0
2X05SMD = smd 1.016 x 3.302: 1 -1.27,-3.81; 2 -1.27,1.27; 3 1.27,-3.81; 4 1.27,1.27; 5 3.81,-3.81; 6 3.81,1.27; 7 6.35,-3.81; 8 6.35,1.27; 9 8.89,-3.81; 10 8.89,1.27
CHIPLED_0805 = smd 1.2 x 1.2: A 0,-1.05; C 0,1.05
SOT363 = smd 0.5 x 1: 1 -0.75,-1.2; 3 0.75,-1.2; 4 0.75,1.2; 6 -0.75,1.2 | smd 0.4 x 1: 2 0,-1.2; 5 0,1.2
SOD-123 = smd 1.4 x 1.4: A 1.85,0; C -1.85,0
1X06 = drill 1.016 long: 1 -6.35,0; 2 -3.81,0; 3 -1.27,0; 4 1.27,0; 5 3.81,0; 6 6.35,0
1X10 = drill 1.016 long: 1 -11.43,0; 2 -8.89,0; 3 -6.35,0; 4 -3.81,0; 5 -1.27,0; 6 1.27,0; 7 3.81,0; 8 6.35,0; 9 8.89,0; 10 11.43,0
1X08 = drill 1.016 long: 1 -8.89,0; 2 -6.35,0; 3 -3.81,0; 4 -1.27,0; 5 1.27,0; 6 3.81,0; 7 6.35,0; 8 8.89,0
1X10-S = drill 1.016 square: 1 -11.43,0 | drill 1.016 octagon: 2 -8.89,0; 3 -6.35,0; 4 -3.81,0; 5 -1.27,0; 6 1.27,0; 7 3.81,0; 8 6.35,0; 9 8.89,0; 10 11.43,0
0805' = smd 1.2 x 1: 1 -1.1,0; 2 1.1,0
INDUCTOR_4X4MM = smd 4.089 x 1.651: P$1 0,1.727; P$2 0,-1.727
JST-PH-2-SMT = smd 1 x 5.5: 1 -1,-1.8; 2 1,-1.8 | smd 1.6 x 3.4: NC1 -3.4,0; NC2 3.4,0
LED-0805 = smd 0.889 x 1.27: + -0.889,0; - 0.889,0
KSS-2EG4430 = smd 1.6 x 1.4: 1 -3.75,0; 2 3.75,0
4UCONN_20329_V2 = smd 1 x 2: BASE@1 -0.75,-2; BASE@2 0.75,-2 | smd 0.4 x 1.35: D+ 0,0.775; D- -0.65,0.775; GND 1.3,0.775; ID 0.65,0.775; VBUS -1.3,0.775 | drill 1.016 pad 1.454 offset: SPRT@1 -3.3,0.9; SPRT@2 3.3,0.9 | drill 1.397 pad 2.5 square: SPRT@3 -3.6,-1.9; SPRT@4 3.6,-1.9 | hole 0.7: -1.95,0; 1.95,0
CHIP-LED0805 = smd 1.2 x 1.2: A 0,-1.05; C 0,1.05
TC26H-SMD = smd 1.27 x 2.54: P$1 -1.27,-5.08; P$2 1.27,-5.08
SM49 = smd 5.08 x 1.778: 1 -4.826,0; 2 4.826,0
SOT23 = smd 1.016 x 1.143: 1 -0.95,-1.016; 2 0.95,-1.016; 3 0,1.016
R0805 = smd 1.3 x 1.5: 1 -0.85,0; 2 0.85,0
M0805 = smd 1.3 x 1.6: 1 -0.95,0; 2 0.95,0
0805'' = smd 1.016 x 1.397: 1 -0.889,0; 2 0.889,0
4P-U-FL = smd 1.016 x 1.016: D -1.524,0; GND3 1.524,0 | smd 2.286 x 0.762: GND1 0,1.397; GND2 0,-1.397
SWITCH-SPST-SMD-A = smd 0.7 x 1.5: 1 -2.25,-1.75; 2 -0.75,-1.75; 3 2.25,-1.75 | smd 1 x 0.6: GND1 -3.65,1; GND3 3.65,1 | smd 1 x 0.8: GND2 -3.65,-1.1; GND4 3.65,-1.1 | hole 0.9: -1.5,0; 1.5,0
LQFP64-10X10MM = smd 1.194 x 0.305: 1 -5.75,3.75; 2 -5.75,3.25; 3 -5.75,2.75; 4 -5.75,2.25; 5 -5.75,1.75; 6 -5.75,1.25; 7 -5.75,0.75; 8 -5.75,0.25; 9 -5.75,-0.25; 10 -5.75,-0.75; 11 -5.75,-1.25; 12 -5.75,-1.75; 13 -5.75,-2.25; 14 -5.75,-2.75; 15 -5.75,-3.25; 16 -5.75,-3.75; 33 5.75,-3.75; 34 5.75,-3.25; 35 5.75,-2.75; 36 5.75,-2.25; 37 5.75,-1.75; 38 5.75,-1.25; 39 5.75,-0.75; 40 5.75,-0.25; 41 5.75,0.25; 42 5.75,0.75; 43 5.75,1.25; 44 5.75,1.75; 45 5.75,2.25; 46 5.75,2.75; 47 5.75,3.25; 48 5.75,3.75 | smd 0.305 x 1.194: 17 -3.75,-5.75; 18 -3.25,-5.75; 19 -2.75,-5.75; 20 -2.25,-5.75; 21 -1.75,-5.75; 22 -1.25,-5.75; 23 -0.75,-5.75; 24 -0.25,-5.75; 25 0.25,-5.75; 26 0.75,-5.75; 27 1.25,-5.75; 28 1.75,-5.75; 29 2.25,-5.75; 30 2.75,-5.75; 31 3.25,-5.75; 32 3.75,-5.75; 49 3.75,5.75; 50 3.25,5.75; 51 2.75,5.75; 52 2.25,5.75; 53 1.75,5.75; 54 1.25,5.75; 55 0.75,5.75; 56 0.25,5.75; 57 -0.25,5.75; 58 -0.75,5.75; 59 -1.25,5.75; 60 -1.75,5.75; 61 -2.25,5.75; 62 -2.75,5.75; 63 -3.25,5.75; 64 -3.75,5.75
SOT23-5 = smd 0.55 x 1.2: 1 -0.95,-1.3; 2 0,-1.3; 3 0.95,-1.3; 4 0.95,1.3; 5 -0.95,1.3
MSOP8 = smd 0.4 x 1.1: 1 -0.975,-2.25; 2 -0.325,-2.25; 3 0.325,-2.25; 4 0.975,-2.25; 5 0.975,2.25; 6 0.325,2.25; 7 -0.325,2.25; 8 -0.975,2.25
MICROSIM = smd 1.5 x 0.9: 1 -0.8,2.5; 2 -0.8,5.04; 3 -0.8,7.58; 5 -0.8,1.23; 6 -0.8,3.77; 7 -0.8,6.31 | smd 2.61 x 1.56: P$1 1.6,-0.8; P$2 14.2,-0.8; P$3 14.2,16.1; P$4 1.6,16.1
BC92 = smd 2.5 x 0.7: 1 -9.7,7.5; 2 -9.7,6.4; 3 -9.7,5.3; 4 -9.7,4.2; 5 -9.7,3.1; 6 -9.7,-1.9; 7 -9.7,-3; 8 -9.7,-4.1; 9 -9.7,-5.2; 10 -9.7,-6.3; 11 -9.7,-7.4; 21 9.7,-7.4; 22 9.7,-6.3; 23 9.7,-5.2; 24 9.7,-4.1; 25 9.7,-3; 26 9.7,-1.9; 27 9.7,3.1; 28 9.7,4.2; 29 9.7,5.3; 30 9.7,6.4; 31 9.7,7.5; 43 9.7,-0.2; 44 9.7,0.9; 45 9.7,2; 48 -9.7,2; 49 -9.7,0.9; 50 -9.7,-0.2 | smd 0.7 x 2.5: 12 -6.35,-11.55; 13 -5.25,-11.55; 14 -4.15,-11.55; 15 -3.05,-11.55; 16 1.65,-11.55; 17 2.75,-11.55; 18 3.85,-11.55; 19 4.95,-11.55; 20 6.05,-11.55; 32 6.05,11.55; 33 4.95,11.55; 34 3.85,11.55; 35 2.75,11.55; 36 1.65,11.55; 37 -3.05,11.55; 38 -4.15,11.55; 39 -5.25,11.55; 40 -6.35,11.55; 41 -1.35,-11.55; 42 -0.05,-11.55; 46 -0.05,11.55; 47 -1.35,11.55
PSON127P500X600X82-9N = smd 0.71 x 0.51: 1 -2.55,1.905; 2 -2.55,0.635; 3 -2.55,-0.635; 4 -2.55,-1.905; 5 2.55,-1.905; 6 2.55,-0.635; 7 2.55,0.635; 8 2.55,1.905 | smd 3.6 x 3.7: 9 0,0
DCJACK_2MM_SMT = smd 2.4 x 2: GND 0,-5.5; GNDBREAK 6.2,-5.5; PWR1 0,5.5; PWR2 6.2,5.5 | hole 1.6: 0,0 | hole 1.8: 4.5,0

### Placement (x,y rotation side)
$H1  66.24,27.84 0 top
$H2  3.25,47.14 0 top
$H3  3.25,13.82 0 top
BOOT  46.33,20.93 0 top
C1  11.38,10.77 90 top
C2  31.29,31.6 270 top
C3  29.26,31.6 270 top
C4  12.6,25.45 90 top
C5  24.79,21.64 180 top
C6  24.18,37.69 0 top
C7  17.68,37.49 0 top
C8  24.18,39.52 0 top
C9  19.66,21.65 0 top
C10  33.32,25.1 90 top
C11  33.32,31.6 270 top
C12  28.65,17.78 90 top
C13  33.53,17.78 90 top
C14  69.7,17.07 180 bottom
C15  65.84,50.6 90 bottom
C16  71.73,43.28 180 bottom
C17  71.73,45.31 180 bottom
C18  70.71,20.93 270 bottom
C19  71.73,47.35 180 bottom
C20  68.28,36.58 270 bottom
C21  61.98,38.4 180 bottom
C22  64.36,19.3 90 top
C23  64.26,10.11 90 top
C24  62.79,45.72 270 bottom
C25  62.79,41.05 270 bottom
C26  60.55,50.6 90 bottom
C27  62.79,50.6 90 bottom
C28  40.24,43.46 180 bottom
C29  46.13,37.13 0 bottom
C30  40.23,41 180 bottom
C31  46.13,38.96 0 bottom
C32  40.23,39.17 180 bottom
C33  40.23,37.34 180 bottom
CC1101  9.32,44.65 0 top
CHG  64.01,15.24 90 top
D3  59.74,41.05 90 bottom
D4  36.98,39.01 270 bottom
JP4  43.51,3.76 0 top
JP5  25.73,3.76 0 top
JP6  16.52,52.01 0 top
JP7  40.97,52.02 180 top
JP9  3.45,30.89 90 top
L1  BLM21BB201SN1D  [0805']  30.4,34.54 0 top
L2  71.93,38.81 180 bottom
LED  8.94,34.95 90 top
LIPO  71.73,17.07 270 top
MODEMCTL  50.19,35.36 270 top
NET  60.68,27.94 180 top
NRST  20.32,13.82 270 top
POWER  71.32,6.3 90 top
PWR  24.87,13.87 270 top
PWRKEY  57.18,15.04 180 top
Q1  31.09,16.15 180 top
Q2  37.8,28.35 270 top
Q3  54.43,19.36 90 top
Q4  54.38,10.11 90 top
Q5  54.38,23.88 90 top
R1  24.77,10.77 0 top
R2  8.94,37.59 0 top
R3  11.38,14.83 270 top
R4  8.74,14.83 90 top
R5  55.93,27.84 90 bottom
R6  55.88,23.83 270 bottom
R7  20.93,38.51 90 top
R8  24.79,18.19 0 top
R9  31.29,25.1 270 top
R10  32.31,28.35 0 top
R11  63.6,21.74 180 bottom
R12  68.28,50.6 270 bottom
R13  63.6,19.3 0 bottom
R14  67.06,41.05 270 bottom
R15  61.77,36.45 180 bottom
R16  69.29,32.72 180 bottom
R17  22R  [0805'']  57.91,45.72 270 bottom
R18  22R  [0805'']  60.55,45.72 270 bottom
R19  4k7  [0805'']  61.34,19.36 270 top
R20  4k7  [0805'']  61.29,10.11 270 top
R21  10k  [0805'']  65.02,41.05 270 bottom
R22  47k  [0805'']  58.29,19.36 90 top
R23  47k  [0805'']  58.24,10.11 90 top
R24  22R  [0805'']  65.02,45.72 270 bottom
R25  0R  [0805'']  48.97,38 270 bottom
R26  4k7  [0805'']  61.29,23.93 270 top
R27  47k  [0805'']  58.24,23.88 90 top
R28  2k2  [0805'']  56.41,27.94 180 top
R29  13,37.59 0 top
R30  13,35.15 0 top
RESET  57.2,5.21 180 top
RF_ANT  49,42.42 90 bottom
S1  72.95,26.82 270 top
SWD  10.49,3.71 0 top
U1  21.13,29.57 180 top
U2  67.67,20.73 180 bottom
U3  71.73,50.6 180 bottom
U4  65.63,35.56 180 bottom
U5  56.85,37.21 0 top
U6  43.7,22.97 0 bottom
U7  -9.75,40.44 0 top  (outside the outline)
U$1  67.06,6.86 0 bottom
USER  15.44,13.82 270 top

### Tracks (layer width: path | path; a pad name or v marks a point on that pad's centre or on a via)
+3V3  (via drill 0.36)
  Top 0.203: 15.38,25.66 U1.48 | U1.1 26.72,25.65 | 7.67,24.13 v7.67,24.43
  Top 0.305: 24.88,25.09 24.88,24.79 24.88,24.57 24.89,24.56 U1.64 | U1.19 23.88,36.06 23.16,36.78 C6.1 | U1.48 15.37,25.81 14.83,25.81 | v7.67,24.43 7.67,16.85 R4.2 | R1.2 25.61,9.61 v21.92,5.92
  Top 0.406: 16.82,37.64 16.76,37.59 R29.2 R30.2
  Top 0.61: 17.48,28.65 17.27,28.65 16.89,29.03 16.89,33.95 16.66,34.19 C7.1 | 17.48,28.65 21.54,28.65 24.88,25.31 | 17.48,28.65 17.48,26.43 16.76,25.71 | 15.38,25.66 16.7,25.66 16.76,25.71 | 24.88,25.31 24.88,24.79 | 24.88,25.31 25.23,25.65 26.72,25.65 26.72,25.66 26.88,25.66 | 23.19,39.55 C8.1 | L1.2 31.5,35.36 33.12,36.98 39.01,36.98 41.05,34.95 41.05,24.38 43.23,22.2 BOOT.2 | v27.23,15.44 28.25,14.43 43.89,14.43 45.06,15.6 BOOT.1 | CC1101.10 19.05,45.97 20.93,44.09 v20.93,41.05 | C4.1 13.46,24.43 14.68,25.66 16.19,25.66 16.25,25.71 16.76,25.71
  Top 0.813: JP5.2 v21.92,5.92 17.5,5.92 16.84,5.26 SWD.6 | C5.1 27.23,20.22 v27.23,15.44 | 23.19,39.55 23.19,40.64 22.78,41.05 v21.74,41.05 v20.93,41.05 | BOOT.1 BOOT.2 | 39.01,36.98 40.64,38.61 52.63,38.61 53.72,37.52 53.72,32.88 54.99,31.62 64.82,31.62 64.88,31.67 64.93,31.67 68.17,34.92 68.17,38.3 70.71,40.84 v70.71,42.06 | C7.1 16.82,37.64 16.82,39.34 v16.89,39.42 | C4.1 v7.67,24.43
  Bottom 0.203: v21.92,5.92 21.92,5.87
  Bottom 0.813: 21.92,5.87 27.23,11.18 v27.23,15.44 v27.23,16.26 v27.23,17.07 | v21.74,41.05 v22.55,41.05 | v16.89,39.42 18.59,41.05 v20.93,41.05 | U3.5 70.78,47.41 C19.1 C17.1 C16.1 v70.71,42.06 | v7.67,24.43 5.03,27.08 JP9.4
  pour Top: 23.77,34.59 23.77,40.39 22.2,40.39 22.2,36.88 22.5,36.58 23.42,36.58 23.57,36.42 23.57,34.59
  pour Top: 17.42,34.59 17.42,38.56 15.65,38.56 15.65,36.73 15.95,36.42 17.02,36.42 17.17,36.27 17.17,34.59
  pour Top: 24.79,24.69 24.79,23.16 24.94,22.71 24.94,20.57 26.77,20.57 26.77,22.4 26.31,22.86 25.55,22.86 25.55,24.69
+4.1V  (via drill 0.36)
  Top 0.813: S1.1 70.73,29.07 70.71,29.06 70.71,27.58 | 70.71,27.58 v70.71,26.01 | S1.2 70.71,27.58
  Top 1.016: v73.56,16.05 72.14,16.05 72.12,16.07
  Top 1.067: 72.12,16.07 LIPO.2
  Bottom 0.203: 68.89,21.95 69.82,22.03 U2.3
  Bottom 0.813: 68.89,21.95 C18.1 v70.71,26.01
  Bottom 1.016: 72.14,20.91 73.15,19.9 73.15,19.71 73.56,19.3 v73.56,16.05
  Bottom 1.067: C18.1 71.1,21.95 72.14,20.91
+5V  (via drill 0.36)
  Top 0.813: JP5.3 24.46,5.77 26.82,8.13 v50.8,8.13 | v60.82,34.75 57.1,34.75 57.1,34.74 v56.69,34.74
  Bottom 0.406: U4.7 65.31,34.06 65.3,34.06 65.3,34.29
  Bottom 0.61: 65.3,34.29 65.05,34.54 64.92,34.54
  Bottom 0.813: C21.1 60.82,38.15 R15.1 v60.82,34.75 60.83,34.74 60.83,34.71 61.38,34.16 63.56,34.16 63.94,34.54 64.92,34.54 | v50.8,8.13 53.65,8.13 54.25,8.74 54.25,12.8 58.52,17.07 58.52,31.46 57.37,32.62 57.37,34.07 v56.69,34.74
BC92_PSM_EINT  (via drill 0.36)
  Top 0.203: MODEMCTL.2 49.73,34.9 49.68,34.9 49.4,34.62 v49.4,27.64
  Bottom 0.203: U6.20 37.65,12.46 43.69,18.49 43.69,23.37 47.95,27.64 v49.4,27.64
BC92_PWRKEY  (via drill 0.36)
  Top 0.305: Q3.3 53.42,16.66 | 53.42,16.66 53.42,15.05 PWRKEY.2 | 53.42,16.66 v55.27,16.66 62.74,16.66 C22.1
  Bottom 0.305: U6.10 v55.26,16.67 v55.27,16.66
BC92_PWRKEY_MCU
  Top 0.203: 52.27,34.09 MODEMCTL.4 51.51,34.09 56.49,29.11 56.49,27.19 56.86,26.82 61.77,26.82 64.41,24.18 64.41,23.32 R19.1
BC92_RESET  (via drill 0.36)
  Top 0.203: Q4.3 52.43,11.05 v52.43,11.18
  Top 0.305: RESET.2 53.37,5.29 Q4.3 63.24,10.11 C23.1
  Bottom 0.203: v52.43,11.18 52.43,14.59 U6.11
BC92_RESET_MCU
  Top 0.203: R20.1 59.9,12.39 51.82,12.39 51.41,12.8 51.41,24.79 52.27,25.65 53.24,25.65 53.65,26.06 53.65,30.53 52.63,31.55 MODEMCTL.6
BC92_RX
  Bottom 0.203: U6.21 34.08,15.65 35.97,15.65 38.41,18.09 38.41,26.62 41.25,29.46 49.38,29.46 51.89,31.98 54.9,31.98 57.04,29.84 57.04,28.01 55.93,26.91 R5.1 55.93,24.83 R6.1
BC92_TX  (via drill 0.36)
  Top 0.203: v48.77,30.28 48.77,27.23 49.53,26.47 MODEMCTL.10
  Bottom 0.203: U6.22 35.57,16.67 37.19,18.29 37.19,27.43 40.03,30.28 v48.77,30.28
BOOT0  (via drill 0.36)
  Top 0.203: U1.60 22.88,22.43 22.38,21.93 v22.38,21.11 | R8.1 22.45,18.19 22.35,18.29 v22.35,18.69
  Bottom 0.203: v22.35,18.69 22.35,21.08 v22.38,21.11
BOOT1
  Top 0.254: R7.1 20.93,36.86 20.31,36.24 19.59,36.24 19.4,36.05 19.4,35.33 U1.28
EN
  Bottom 0.203: U4.2 65.31,38.35 66.04,39.08 66.04,39.83 66.31,40.1 R14.2
GND  (via drill 0.36)  (1 unrouted)
  Top 0.203: U1.63 24.38,22.76 | C7.2 18.69,38.74 19.02,39.07 19.02,39.55 20.12,40.64 20.12,42.02 | 20.12,42.06 20.12,42.02 | 20.12,42.02 v20.09,41.99 | v21.95,42.47 22.76,42.47 v22.96,42.27
  Bottom 0.203: v20.09,41.99 20.57,42.47 v21.95,42.47
  Bottom 0.305: U$1.GND 67.06,2.36 66.66,2.75 66.66,3.24 66.45,3.45
  other vias: 11.18,25.6 15.24,20.52 23.77,20.32 24.99,15.44 61.77,35.1 62.48,35.1 63.17,35.1 31.5,17.27 37.39,29.46 60.53,42.82 58.09,38.35 57.48,38.76 59.59,41.61 59.36,37.74 41.66,15.44 42.47,15.44 43.28,15.44 34.54,31.7 30.07,52.63 30.89,49.38 19.28,39.96 23.77,42.27 21.95,43.28 35.56,35.97 43.08,37.39 67.28,38.76 64.64,38.96 69.47,35.2 69.88,34.59 70.69,34.59 71.7,34.59 72.72,34.59 63.83,43.43 61.59,43.43 64.24,50.55 61.59,50.55 62.56,23.83 7.44,36.13 6.78,36.91 6.78,36.13 8.1,36.13
  pour Bottom (rank 6): -1.63,57.71 76.4,57.71 76.4,-3.25 -1.63,-3.25
  pour Top (rank 6): 76.4,57.71 76.4,-3.25 -1.63,-3.25 -1.63,57.71
I2C1_SCL  (via drill 0.36)
  Top 0.203: U1.61 23.37,23.83 23.38,23.84 23.38,24.5 20.06,27.82 19.3,27.82 19.29,27.81 v18.95,27.81 | JP6.1 9.41,47.69 9.41,44.16 10.3,43.28 13.41,43.28 14.45,42.24 v14.45,39.12 14.14,38.81 12.6,38.81 12.39,38.61 12.39,37.93 R29.1
  Bottom 0.203: v18.95,27.81 18.8,27.96 18.8,29.97 18.19,30.58 16.36,30.58 14.63,32.31 14.63,38.95 v14.45,39.12
I2C1_SDA  (via drill 0.36)
  Top 0.203: U1.62 23.88,24.91 v21.13,27.66 | v19.43,43.13 19.28,43.28 15.44,43.28 14.22,44.5 14.22,48.97 13.61,49.58 8.74,49.58 7.63,50.68 JP6.2 | R30.1 11.62,35.15 10.92,35.85 9.27,35.85 8.96,35.55 8.96,34.38 8.62,34.05 6.8,34.05 4.88,35.97 2.64,35.97 2.23,36.37 2.23,37.59 3.05,38.41 4.06,38.41 5.49,39.83 v5.49,44.3
  Bottom 0.203: v21.13,27.66 21.13,28.78 18.52,31.39 16.97,31.39 16.46,31.9 16.46,34.45 16.08,34.83 16.08,39.8 19.41,43.13 v19.43,43.13 | v5.49,44.3 7.63,46.45 JP6.2
JNTRST  (via drill 0.36)
  Top 0.203: v17.65,25.4 17.93,25.12 20.33,25.12 20.75,24.71 20.75,24.7 20.88,24.57 U1.56
  Bottom 0.203: v17.65,25.4 17.15,25.91 17.15,26.97 15.85,28.27 15.85,28.65 13.41,31.09 13.41,37.8 13.01,38.2 13.01,41.59 19.57,48.16 33.03,48.16 35.47,50.6 36.38,50.6 37.16,51.38 JP7.6
JTCK/SWCLK
  Top 0.203: SWD.5 14.3,5.36 17.38,8.44 U1.49
JTDO/SWO  (via drill 0.36)
  Top 0.203: U1.55 20.34,23.86 20.34,24.54 20.16,24.72 17.1,24.72 16.26,23.87 v16.26,23.76 | v10.57,7.32 7.75,7.32 SWD.1
  Bottom 0.203: JP7.4 40.01,49.79 36.08,49.79 36.07,49.78 35.8,49.78 31.54,45.52 23.25,45.52 23.23,45.49 22.7,45.49 22.67,45.52 20.32,45.52 15.04,40.23 15.04,39.44 15.09,39.39 15.09,38.86 15.04,38.81 15.04,32.48 16.53,30.99 18.35,30.99 20.51,28.84 20.51,27.93 20.5,27.92 20.5,27.4 21.13,26.76 21.13,25.23 19.57,23.66 16.16,23.66 v16.26,23.76 16.26,8.94 14.63,7.32 v10.57,7.32
JTMS/SWDIO  (via drill 0.36)
  Top 0.203: v16.51,26.7 16.4,26.82 U1.46 | v12.39,22.55 v12.39,19.89
  Bottom 0.203: v12.39,22.55 12.39,22.69 16.41,26.7 v16.51,26.7 | SWD.3 9.22,16.74 12.37,19.89 v12.39,19.89
N$1  (via drill 0.36)
  Top 0.203: BOOT.3 47.6,15.09 44.5,11.99 29.16,11.99 v28.98,12.17 | v19.54,38.65 20.36,39.46 R7.2
  Bottom 0.203: v28.98,12.17 28.45,12.7 28.45,21.95 27.84,22.55 22.76,22.55 21.95,23.37 21.95,28.55 18.64,31.85 18.62,31.85 18.57,31.9 17.68,31.9 16.87,32.72 16.87,36.17 19.3,38.61 19.51,38.61 v19.54,38.65
N$3
  Top 0.305: PWR.A 23.91,13.77 R1.1
N$5
  Bottom 0.203: R12.1 69.73,53 72.37,53 72.68,52.7 U3.3
N$6
  Bottom 0.813: RF_ANT.D 49,38.91 R25.1 47.22,38.89 C31.1
N$7
  Top 0.203: C11.2 33.33,28.41 R10.2
  Top 0.305: Q2.1 35.41,30.58 C11.2
N$8
  Top 0.203: R9.2 31.29,22.71 Q1.P$1 32.36,19.96 C13.2
N$9  (via drill 0.36)
  Top 0.203: CHG.C 62.99,15.27 62.99,16.05 63.4,16.46 64.41,16.46 65.63,17.68 65.63,20.32 v65.69,20.37
  Bottom 0.203: v65.69,20.37 65.36,20.37 65.33,20.41 63.98,20.41 R11.1
N$10  (via drill 0.36)
  Top 0.203: U5.7 57.13,43.52 61.57,47.95 v64.88,47.95
  Bottom 0.203: 62.79,48.56 C27.1 62.99,49.78 64.62,49.78 64.88,49.52 v64.88,47.95 64.88,46.75 R24.1 65.02,46.94
N$11
  Bottom 0.305: R11.2 66.43,21.74 U2.1
N$12  (via drill 0.36)
  Top 0.305: v56.35,46.35 56.05,46.05 U5.3
  Bottom 0.305: C26.1 59.13,49.58 58.12,48.56 58.12,46.81 R17.1 56.6,46.61 v56.35,46.35
N$13  (via drill 0.36)
  Top 0.203: U5.2 57.08,42.25 v57.71,42.88
  Bottom 0.203: R18.1 59.33,45.39 59.33,43.89 58.32,42.88 v57.71,42.88
  Bottom 0.305: R18.1 62.66,46.61 C24.1
N$14
  Top 0.254: R23.1 R20.2
  Top 0.305: Q4.1 58.18,9.16 R23.1
N$15
  cutout Bottom: 49.89,43.84 47.75,43.84 47.75,41.5 49.89,41.5
N$16
  Top 0.203: Q5.3 55.96,23.88 56.27,24.19 56.27,25.82 55.52,26.57 R28.2
N$17
  Top 0.254: R28.1 NET.-
N$18
  Top 0.203: R26.2 61.24,22.99 R27.1 58.18,22.93 Q5.1
N$19
  Top 0.203: R3.2 C1.2
N$20
  Bottom 0.305: R13.1 66.59,19.3 U2.5
N$21
  Bottom 0.203: R16.1 67.2,32.72 U4.5 66.61,33.84 65.63,34.82 65.63,34.84 65.22,35.26 65.19,35.26 64,36.45 R15.2
N$22
  Bottom 0.203: U4.1 64.66,36.58 67.3,33.93 73.15,33.93 74.37,35.15 74.37,39.62 73.46,40.54 L2.P$2
N$25
  Top 0.203: BOOT.4 46.33,20.93 46.33,15.04 44.09,12.8 28.85,12.8 25.74,15.92 R8.2
N$26
  Top 0.203: R2.1 6.5,37.59 6.1,37.19 6.1,35.56 6.71,34.95 LED.C
N$29  (via drill 0.36)
  Top 0.203: v50.9,30.07 50.9,29.57 MODEMCTL.8
  Bottom 0.203: R5.2 55.93,30.05 54.48,31.5 52.02,31.5 50.9,30.38 v50.9,30.07
N$36
  Top 0.203: Q3.1 58.23,18.41 R22.1 R19.2
NETLIGHT  (via drill 0.36)
  Top 0.203: 61.37,24.82 R26.1 60.53,24.82 59.54,25.81 v57.45,25.81
  Bottom 0.203: 48.95,11.38 U6.13 48.95,18.68 52.22,21.95 54.66,21.95 55.07,21.54 56.42,21.54 56.98,22.1 56.98,25.34 v57.45,25.81
NRST  (via drill 0.36)
  Top 0.203: C9.1 18.64,11.75 NRST.2 21.13,10.88 21.13,11.91 v21.06,11.99 | v27.64,21.74 29.06,23.16 v29.06,25.6
  Top 0.254: U1.7 26.86,28.8 26.15,28.8 25.75,28.4 v25.75,27.23
  Bottom 0.203: v25.75,27.23 24.79,27.23 24.59,27.03 24.59,25.2 24.74,25.04 27.43,25.04 27.99,25.6 v29.06,25.6 | v27.64,21.74 27.23,22.15 22.52,22.15 21.06,20.68 v21.06,11.99 21.06,11.23 19.38,9.55 JP5.1 19.38,2.52 18.29,1.42 7.52,1.42 6.68,2.26 SWD.2
OSC32_IN
  Top 0.203: U1.3 29.08,26.82 29.82,26.09 Q1.P$2 29.82,19.96 C12.2
OSC32_OUT
  Top 0.203: U1.4 29.48,27.32 30.75,26.05 R9.1
OSC_IN
  Top 0.203: U1.5 26.93,27.77 29.63,27.77 30.28,27.13 32.51,27.13 33.33,26.31 C10.2
  Top 0.305: Q2.2 35.41,26.11 C10.2
OSC_OUT
  Top 0.203: U1.6 31.33,28.32 R10.1
PA0  (via drill 0.36)
  Top 0.203: U1.14 26.18,32.32 v25.49,31.62
  Bottom 0.203: v25.49,31.62 26.01,31.62 26.64,32.26 26.64,36.6 36.98,46.94 37.25,46.94 37.93,46.94 52.52,46.94 53.68,45.78 53.68,38.76 58.08,34.36 58.08,32.91 59.33,31.66 59.33,16.75 55.04,12.45 55.04,8.3 54.06,7.32 39.62,7.32 37.16,4.85 JP4.1
PA1  (via drill 0.36)
  Top 0.203: U1.15 25.75,32.82 v25.48,32.54
  Bottom 0.203: v25.48,32.54 25.76,32.82 25.87,32.82 26.24,33.19 26.24,33.72 26.01,33.94 26.01,36.54 36.81,47.35 37.08,47.35 37.09,47.35 38.09,47.35 | 46.57,6.91 54.23,6.91 55.45,8.13 55.45,12.28 59.74,16.58 59.74,31.82 58.49,33.08 58.49,34.53 54.09,38.93 54.09,45.95 52.69,47.35 38.09,47.35 | 38.09,47.35 | 46.57,6.91 | JP4.2 39.7,5.77 40.84,6.91 46.57,6.91
PA2
  Top 0.203: JP7.2 47.32,48.13 37.8,38.61 29.46,38.61 27.84,36.98 27.84,33.53 27.64,33.33 26.89,33.33 U1.16
PA3  (via drill 0.36)
  Top 0.203: U1.17 24.88,35.45 30.07,40.64 36.58,40.64 v45.92,49.99
  Bottom 0.203: 49.8,52.09 JP7.1 47.83,49.99 v45.92,49.99
PA4  (via drill 0.36)
  Top 0.203: U1.20 23.38,34.38 24.31,33.45 v25.6,33.45 | CC1101.4 10.59,46.13 10.57,46.15 v10.57,48.56 | v17.58,49.43 19.66,47.35 v19.71,47.35 | v25.81,47.14 29.26,43.69 v29.26,41.66
  Bottom 0.203: 55.9,12.17 60.15,16.41 60.15,31.99 58.89,33.25 58.89,34.7 54.49,39.1 54.49,46.12 52.86,47.75 38.26,47.75 | 55.9,12.17 | 55.9,12.17 55.85,12.12 55.85,7.79 54.56,6.5 46.94,6.5 | 38.26,47.75 36.92,47.75 36.91,47.75 36.65,47.75 30.51,41.62 | 38.26,47.75 | 30.51,41.62 25.6,36.71 v25.6,33.45 | 46.94,6.5 | 46.94,6.5 43.28,6.5 42.24,5.46 JP4.3 | 30.51,41.62 29.3,41.62 v29.26,41.66 | v17.58,49.43 15.29,47.14 13.21,47.14 11.79,48.56 v10.57,48.56 | v19.71,47.35 25.6,47.35 v25.81,47.14
PA5  (via drill 0.36)
  Top 0.203: v23.06,33.8 22.88,33.98 U1.21 | JP6.5 15.25,51.19 16.87,49.58 16.87,44.5 17.58,43.79 20.04,43.79 v20.07,43.76 20.07,42.87 19.69,42.49 19.17,42.49 18.79,42.88 16.66,42.88 15.67,41.88 CC1101.7
  Bottom 0.203: v23.06,33.8 22.73,34.14 22.73,37.56 25.81,40.64 25.81,43.69 24.99,44.5 20.8,44.5 v20.07,43.76
PA6  (via drill 0.36)
  Top 0.203: U1.22 22.38,33.5 v22.96,32.92 | v22.96,43.28 21.84,44.4 21.84,47.96 JP6.6 | CC1101.8 v15.67,49.45
  Bottom 0.203: v22.96,32.92 22.28,33.6 22.28,37.85 25.4,40.97 25.4,43.52 24.82,44.09 23.77,44.09 v22.96,43.28 | v15.67,49.45 15.67,49.92 JP6.6
PA7  (via drill 0.36)
  Top 0.203: U1.23 21.88,33.08 v21.87,33.07 | v23.98,43.28 23.86,43.28 22.33,44.81 22.33,48.16 20.33,50.15 JP6.7 | v13.16,48.32 13.16,45.96 CC1101.6
  Bottom 0.203: v21.87,33.07 21.87,38.02 24.99,41.14 24.99,42.67 24.38,43.28 v23.98,43.28 | JP6.7 18.4,50.08 17.19,50.08 16.31,49.2 16.31,49.19 15.94,48.82 15.93,48.82 15.85,48.74 13.59,48.74 v13.16,48.32
PA8  (via drill 0.36)
  Top 0.203: U1.41 13.2,29.32 v13.06,29.46
  Bottom 0.203: v13.06,29.46 12.6,29.92 12.6,32.72 10.77,34.54 10.77,40.51 19.23,48.97 29.03,48.97 JP7.8
PA11  (via drill 0.36)
  Top 0.203: v9.14,27.43 9.35,27.23 10.16,27.23 10.75,27.82 U1.44
  Bottom 0.203: v9.14,27.43 8.74,27.84 8.74,32.51 5.82,35.43 5.82,39.95 JP9.10
PA12  (via drill 0.36)
  Top 0.203: U1.45 15.34,27.36 14.66,27.36 14.65,27.37 11.28,27.37 10.53,26.62 v8.74,26.62
  Bottom 0.203: JP9.9 5.16,38.08 5.16,35.48 8.13,32.51 8.13,27.23 v8.74,26.62
PB0  (via drill 0.36)
  Top 0.203: U1.26 20.38,34.4 19.76,33.78 19.76,33.06 20.92,31.9 21.97,31.9 v22.25,32.18
  Bottom 0.203: v22.25,32.18 22.25,31.92 22.9,31.27 23.92,31.27 24.48,31.27 24.84,31.62 24.84,36.52 27.54,39.22 27.54,41.75 29.6,43.81 32.12,43.81 36.48,48.16 36.75,48.16 38.43,48.16 | 56.29,11.98 60.55,16.24 60.55,32.16 59.3,33.41 59.3,34.87 54.9,39.26 54.9,46.29 53.03,48.16 38.43,48.16 | 56.29,11.98 | 56.29,11.98 56.26,11.95 56.26,7.62 54.73,6.1 47.35,6.1 | 38.43,48.16 | 47.35,6.1 | 47.35,6.1 45.72,6.1 44.78,5.16 JP4.4
PB5  (via drill 0.36)
  Top 0.203: v18.29,26.06 18.82,25.53 20.5,25.53 21.15,24.88 21.15,24.87 21.38,24.64 U1.57
  Bottom 0.203: v18.29,26.06 18.29,26.4 16.26,28.43 16.26,29.26 13.82,31.7 13.82,38 13.41,38.41 13.41,39.86 20.49,46.94 23.37,46.94 24.18,46.13 31.57,46.13 35.64,50.19 39.02,50.19 39.7,50.88 JP7.5
PB6  (via drill 0.36)
  Top 0.203: U1.58 21.88,24.72 21.56,25.04 20.42,26.19 v19.56,26.19 | JP6.8 22.87,46.21 v22.96,46.13
  Bottom 0.203: v19.56,26.19 19.33,26.42 19.33,26.51 17.88,27.96 17.88,28.77 18.39,29.28 18.39,29.8 18.02,30.18 15.95,30.18 14.22,31.9 14.22,38.2 13.82,38.61 13.82,39.62 20.73,46.53 22.55,46.53 v22.96,46.13
PB12  (via drill 0.36)
  Top 0.203: U1.33 14.63,33.32 | 14.63,33.32 14.23,33.32 | CC1101.5 11.99,39.7 v11.99,39.17 11.63,38.81 6.91,38.81 5.33,37.24 JP9.8 | 14.63,33.32 14.62,33.33 12.89,33.33 v12.39,33.82
  Bottom 0.203: JP7.7 34.62,50.67 32.51,48.56 19.4,48.56 11.99,41.15 v11.99,39.17 11.99,34.34 12.39,33.93 v12.39,33.82
PB13  (via drill 0.36)
  Top 0.203: JP9.7 5.28,34.7 6.62,33.36 9.55,33.36 10.16,33.97 10.16,34.34 | 10.16,34.34 10.16,35.19 LED.A | 10.16,34.34 v10.79,33.6 11.14,33.36 11.79,33.36 12.34,32.82 U1.34
PB14
  Top 0.203: U1.35 12.26,32.32 11.62,32.96 5.93,32.96 5.08,32.11 3.5,32.11 JP9.6
PB15
  Top 0.203: U1.36 11.06,31.82 10.77,32.11 5.94,32.11 JP9.5
PC0  (via drill 0.36)
  Top 0.203: v23.16,31.9 23.72,31.34 23.72,31.33 25.74,29.32 U1.8
  Bottom 0.203: v23.16,31.9 23.16,32.22 23.7,32.76 23.7,36.53 26.71,39.54 26.71,42.06 29.26,44.62 31.79,44.62 36.14,48.97 36.41,48.97 53.37,48.97 55.71,46.63 55.71,39.6 60.11,35.2 60.11,33.75 61.37,32.5 61.37,15.91 57.07,11.61 57.07,7.29 55.07,5.28 50.74,5.28 49.86,4.4 JP4.6
PC1  (via drill 0.36)
  Top 0.203: v24.18,31.9 24.13,31.85 24.13,31.5 25.81,29.82 U1.9
  Bottom 0.203: 56.78,11.9 60.96,16.07 60.96,32.33 59.7,33.58 59.7,35.03 55.31,39.43 55.31,46.46 53.2,48.57 38.6,48.57 | 56.78,11.9 | 56.78,11.9 56.66,11.78 56.66,7.46 54.9,5.69 47.95,5.69 47.32,5.05 JP4.5 | 38.6,48.57 36.58,48.57 36.58,48.56 36.31,48.56 31.96,44.21 29.43,44.21 27.11,41.9 27.11,39.37 24.18,36.44 v24.18,31.9 | 38.6,48.57
PC7  (via drill 0.36)
  Top 0.203: U1.38 14.7,30.82 14.61,30.91 13.66,30.91 13.65,30.91 11,30.91 v10.77,30.68
  Bottom 0.203: JP6.9 25.41,50.61 24.59,49.78 18.9,49.78 9.75,40.64 9.75,33.16 10.76,32.16 10.76,31.5 v10.77,30.68
PC13  (via drill 0.36)
  Top 0.203: U1.2 24.99,26.32 21.77,29.54 v17.75,29.54 | R4.1 8.74,12.39 C1.1 11.69,10.07 13.82,10.07 | 13.82,10.07 USER.2 | v13.82,22.35 13.82,10.07
  Bottom 0.203: v17.75,29.54 16.74,29.54 16.66,29.46 16.66,28.65 17.48,27.84 17.48,27.79 18.92,26.34 18.92,25.77 17.92,24.77 16.72,24.77 16.69,24.8 15.54,24.8 13.82,23.08 v13.82,22.35
RF_ANT
  Bottom 0.61: U6.39 48.97,34.54 48.97,35.56
  Bottom 0.813: 48.97,35.56 R25.2 47.17,37.11 C29.1
SIM1_CLK  (via drill 0.36)
  Top 0.203: v59.13,47.75 58.93,47.95 57.05,47.95 53.88,44.78 v51.99,44.78 | v59.54,38.81 59.54,40.31 v59.66,40.36
  Bottom 0.203: U6.30 34.95,29.37 35.56,29.98 35.56,32.11 33.73,33.93 33.73,42.54 37.32,46.13 50.65,46.13 v51.99,44.78 | v59.13,47.75 59.13,46.05 R17.2 56.29,43.2 56.29,40.23 57.1,39.42 58.93,39.42 v59.54,38.81 | D3.5 60.27,41.05 v59.66,40.36
SIM1_DATA  (via drill 0.36)
  Top 0.203: v52.48,45.52 53.82,45.52 56.9,48.59 64.03,48.59 v64.14,48.69
  Bottom 0.203: U6.29 35.38,28.27 35.97,28.85 35.97,32.51 34.14,34.34 34.14,42.37 37.49,45.72 50.16,45.72 51.73,44.15 52.26,44.15 52.63,44.52 52.63,45.36 v52.48,45.52 | D3.4 61.37,41.8 62.01,41.16 64.25,41.16 R21.1 R24.2 63.78,46.08 63.78,48.13 v64.14,48.69
SIM1_RST  (via drill 0.36)
  Top 0.203: v57.33,41.56 57.8,41.56 58.73,40.64 58.73,38 58.41,37.68 54.89,37.68 52.4,40.17 52.4,43.05 v53.03,43.69
  Bottom 0.203: v57.33,41.56 57.33,41.63 57.3,41.66 57.44,41.8 D3.3 60.55,44.01 R18.2 | U6.28 32.72,27.17 31.9,27.98 31.9,41.28 37.15,46.53 37.42,46.53 37.76,46.53 | 37.76,46.53 | 37.76,46.53 49.58,46.53 52.36,46.53 53.11,45.78 53.11,43.76 v53.03,43.69
SIM1_VDD  (via drill 0.36)
  Top 0.203: v57.35,40.08 56.98,39.71 U5.1 53.76,39.71 v53.03,40.44
  Bottom 0.203: C25.2 62.52,40.3 61.92,40.3 61.35,39.73 59.4,39.73 58.83,40.3 D3.1 57.57,40.3 v57.35,40.08 | U6.27 35.62,26.07 36.53,26.98 36.53,27.23 36.58,27.27 36.58,32.51 34.54,34.54 34.54,42.2 37.66,45.31 49.99,45.31 53.03,42.27 v53.03,40.44
  Bottom 0.305: C25.2 64.9,40.03 R21.2
STM_PSM_EINT  (via drill 0.36)
  Top 0.203: U1.24 21.38,33.73 21.18,33.53 v21.18,32.54 | 44.7,36.37 MODEMCTL.1 44.65,34.9 44.6,34.9 43.28,33.58 v43.28,28.65
  Bottom 0.203: v21.18,32.54 21.18,32.35 21.99,31.55 22,31.55 24.13,29.41 24.13,25.04 24.54,24.64 28.82,24.64 30.48,22.98 30.48,15.44 31.29,14.63 36.58,14.63 41.05,19.1 41.05,26.42 v43.28,28.65
STM_PWRKEY  (via drill 0.36)
  Top 0.203: v20.4,33.43 20.88,33.91 U1.25 | MODEMCTL.3 44.65,32.36 44.6,32.36 44.3,32.05 44.3,30.09 43.97,29.76 43.97,28.12 v43.28,27.43
  Bottom 0.203: v20.4,33.43 20.4,32.43 23.72,29.1 23.72,24.64 24.13,24.23 28.62,24.23 30.07,22.77 30.07,15.28 31.12,14.22 36.74,14.22 41.45,18.93 41.45,25.6 v43.28,27.43
STM_RESET  (via drill 0.36)
  Top 0.203: v19.1,33.86 19.66,34.41 19.88,34.63 U1.27 | MODEMCTL.5 46.33,31.55 44.37,29.59 44.37,27.62 43.28,26.53 v43.28,26.42
  Bottom 0.203: v19.1,33.86 19.76,33.2 19.76,32.49 23.32,28.93 23.32,23.96 23.45,23.82 28.45,23.82 29.67,22.61 29.67,15.11 30.96,13.82 36.91,13.82 41.86,18.76 41.86,24.99 v43.28,26.42
STM_RX  (via drill 0.36)
  Top 0.203: U1.30 18.38,34.62 17.78,34.02 v17.78,33.83 | v43.28,24.38 45.36,26.47 MODEMCTL.9
  Bottom 0.203: v17.78,33.83 17.78,33.27 18.79,32.26 18.84,32.26 22.48,28.62 22.48,23.65 23.16,22.96 28.01,22.96 28.85,22.11 28.85,14.43 30.48,12.8 37.19,12.8 43.08,18.69 43.08,24.18 v43.28,24.38
STM_TX  (via drill 0.36)
  Top 0.203: U1.29 18.88,34.54 18.47,34.12 18.47,33.55 v19.1,32.92 | MODEMCTL.7 46.18,28.8 46.13,28.8 43.92,26.59 43.92,26.15 43.28,25.52 v43.28,25.4
  Bottom 0.203: v19.1,32.92 19.36,32.66 19.36,32.32 22.91,28.76 22.91,23.79 23.33,23.37 28.18,23.37 29.26,22.28 29.26,14.94 30.79,13.41 37.08,13.41 42.47,18.8 42.47,24.59 v43.28,25.4
USART1_RX  (via drill 0.36)
  Top 0.203: v15.67,34.34 15.65,34.34 16.29,33.7 16.29,28.54 16.06,28.32 15.44,28.32 | 15.44,28.32 U1.43 10.42,28.32 10.17,28.07 8.88,28.07 6.71,25.89 6.71,24.18 4.52,22 JP9.2 | 15.4,28.36 15.44,28.32
  Bottom 0.203: v15.67,34.34 15.67,40.29 20.4,45.03 31.62,45.03 35.97,49.38 36.24,49.38 42.14,49.38 JP7.3
USART1_TX  (via drill 0.36)
  Top 0.203: U1.42 10.02,28.82 v9.93,28.73 8.29,28.73 4.1,24.54 JP9.3
  Bottom 0.203: v9.93,28.73 11.4,30.2 11.4,30.95 11.38,30.97 11.38,32.11 10.16,33.33 10.16,40.47 19.07,49.38 25.32,49.38 JP6.10
V+  (via drill 0.36)
  Top 0.203: NET.+ 61.62,27.89 64.94,24.57 S1.3
  Top 0.305: v62,29.67 62,28.27 61.62,27.89
  Top 1.27: v55.88,32.92 v63.4,32.92 66.23,35.75 v66.23,36.58
  Bottom 0.203: 65.96,37.73 U4.3
  Bottom 0.305: v63.4,32.92 62.38,32.92 61.98,32.51 61.98,29.67 v62,29.67
  Bottom 0.406: 65.96,36.77 65.96,37.73
  Bottom 0.61: 70.71,51 70.76,51.05 70.79,51.05 70.79,51.89 U3.1
  Bottom 0.813: L2.P$1 71.13,37.48 68.89,37.48 | 68.89,37.48 C20.1 67.48,36.69 67.42,36.69 67.31,36.58 v66.23,36.58 65.96,36.77 | C15.1 65.9,49.65 R12.2 | R12.2 69.36,49.65 70.71,51 | R14.1 68.54,42 | 68.54,42 68.89,41.66 68.89,37.48 | R12.2 68.28,42.27 68.54,42
  Bottom 1.27: v55.88,32.92 51.5,32.92 50.13,31.55 40.38,31.55 39.76,32.17 39.76,34.52
  pour Bottom: 35.76,38.81 35.76,42.29 37.59,42.27 37.59,44.68 37.57,44.7 37.59,44.7 40.28,44.73 40.28,36.58 40.34,36.42 38.2,36.37 38.2,38.81
  pour Bottom (no thermals): 40.34,36.42 40.34,33.38 38.35,33.38 38.35,36.42
VBUS  (via drill 0.36)
  Top 0.203: CHG.A 65.06,14.46 v64.62,14.02
  Top 0.406: POWER.VBUS 70.14,4.59 v69.07,4.59
  Top 0.813: JP5.6 32.08,5.26 33.12,6.3 50.02,6.3 51.23,5.09 51.23,5.07 52.53,3.77 63.38,3.77 v64.21,4.6
  Bottom 0.813: U2.4 68.62,17.14 C14.1 66.04,17.07 65.02,16.05 65.02,14.43 v64.62,14.02 62.95,12.36 U$1.PWR2 60.76,12.66 60.76,6.3 62.46,4.59 v64.21,4.59 | v64.21,4.59 v69.07,4.59 | v64.21,4.59 v64.21,4.6
VDD
  Top 0.203: L1.1 29.26,34.57 29.26,36.78 30.34,37.86 38.54,37.86 51.41,50.73 51.41,52.83 50.19,54.05 11.38,54.05 10.17,52.85 JP6.3
  pour Top: 26.21,32.21 28.24,32.21 28.24,35.46 30.28,35.46 30.28,33.63 32.31,33.63 32.31,31.6 26.21,31.6
VSS
  Top 0.254: C3.2 28.53,31.32 U1.12
  Top 0.305: C3.2 C2.2

### Text on the board
tPlace: I2C1 | SPI 1 | TX2 | RX2 | CAN1 | NSS | SCK | SPI 2 | MOSI | + | MISO | + | OFF | ON | INSERT MICRO SIMCARD | 9088 / 4007 / 7733 / 3295 | NRST | 3V3 | 5V | GND | GND | A0 | A1 | A4 | B0 | C1 | C0 | VBUS | WKUP | NSS1
bPlace: STM32F103RBT6 | Quectel BC92 | DC 5V | QUECTEL BC92
tNames: SCL | SDA | SCK | MISO | MOSI | B8 | B9 | VDDA | GND | A5 | A6 | A7 | B6 | C7 | A9 | A08 | B12 | B04 | B05 | B03 | A10 | A02 | A03 | A11 | RX | A12 | TX | Add ws2812 / stitch / check antenna trace | B12 | B13 | IDEABOARD V2.0 | INT | B14 | PKY | B15 | RST | 3V3 | TXD | USART1 | TX | RXD | RX | BOOT0 | GND | 1 | 0 | 1 | 0 | BOOT1 | CONFIG | B0 | B1 | MODE | X | 0 | MAIN FLASH | (BC92) | SWDIO | SWCLK | 0 | 1 | SYS MEMORY | NRST | GND | 3V3 | 1 | 1 | eSRAM | ADC12 IN | SWO | (BC92)
bNames: http://iot.ideamart.io | 5V
bStop: 2020/11/01
ReferenceLC: L | TX | RX | PC1 | PC2
tDocu: Reference Designs ARE PROVIDED "AS IS" AND "WITH ALL FAULTS. Arduino DISCLAIMS ALL OTHER WARRANTIES, EXPRESS OR IMPLIED, | REGARDING PRODUCTS, INCLUDING BUT NOT LIMITED TO, ANY IMPLIED WARRANTIES OF MERCHANTABILITY OR FITNESS FOR A PARTICULAR PURPOSE | Arduino may make changes to specifications and product descriptions at any time, without notice. The Customer must not | rely on the absence or characteristics of any features or instructions marked "reserved" or "undefined." Arduino reserves | these for future definition and shall have no responsibility whatsoever for conflicts or incompatibilities arising from future changes to them. | The product information on the Web Site or Materials is subject to change without notice. Do not finalize a design with this information. | Original Design By: | M.Banzi | D.Cuartielles | T.Igoe | G.Martino | D.Mellis
214bmp: D:/SmartProjects/Snc/a4_bn_logo2.bmp